# EAGLE design lastboard (EAGLE 7.6.0)

## Sheet 1 of 5
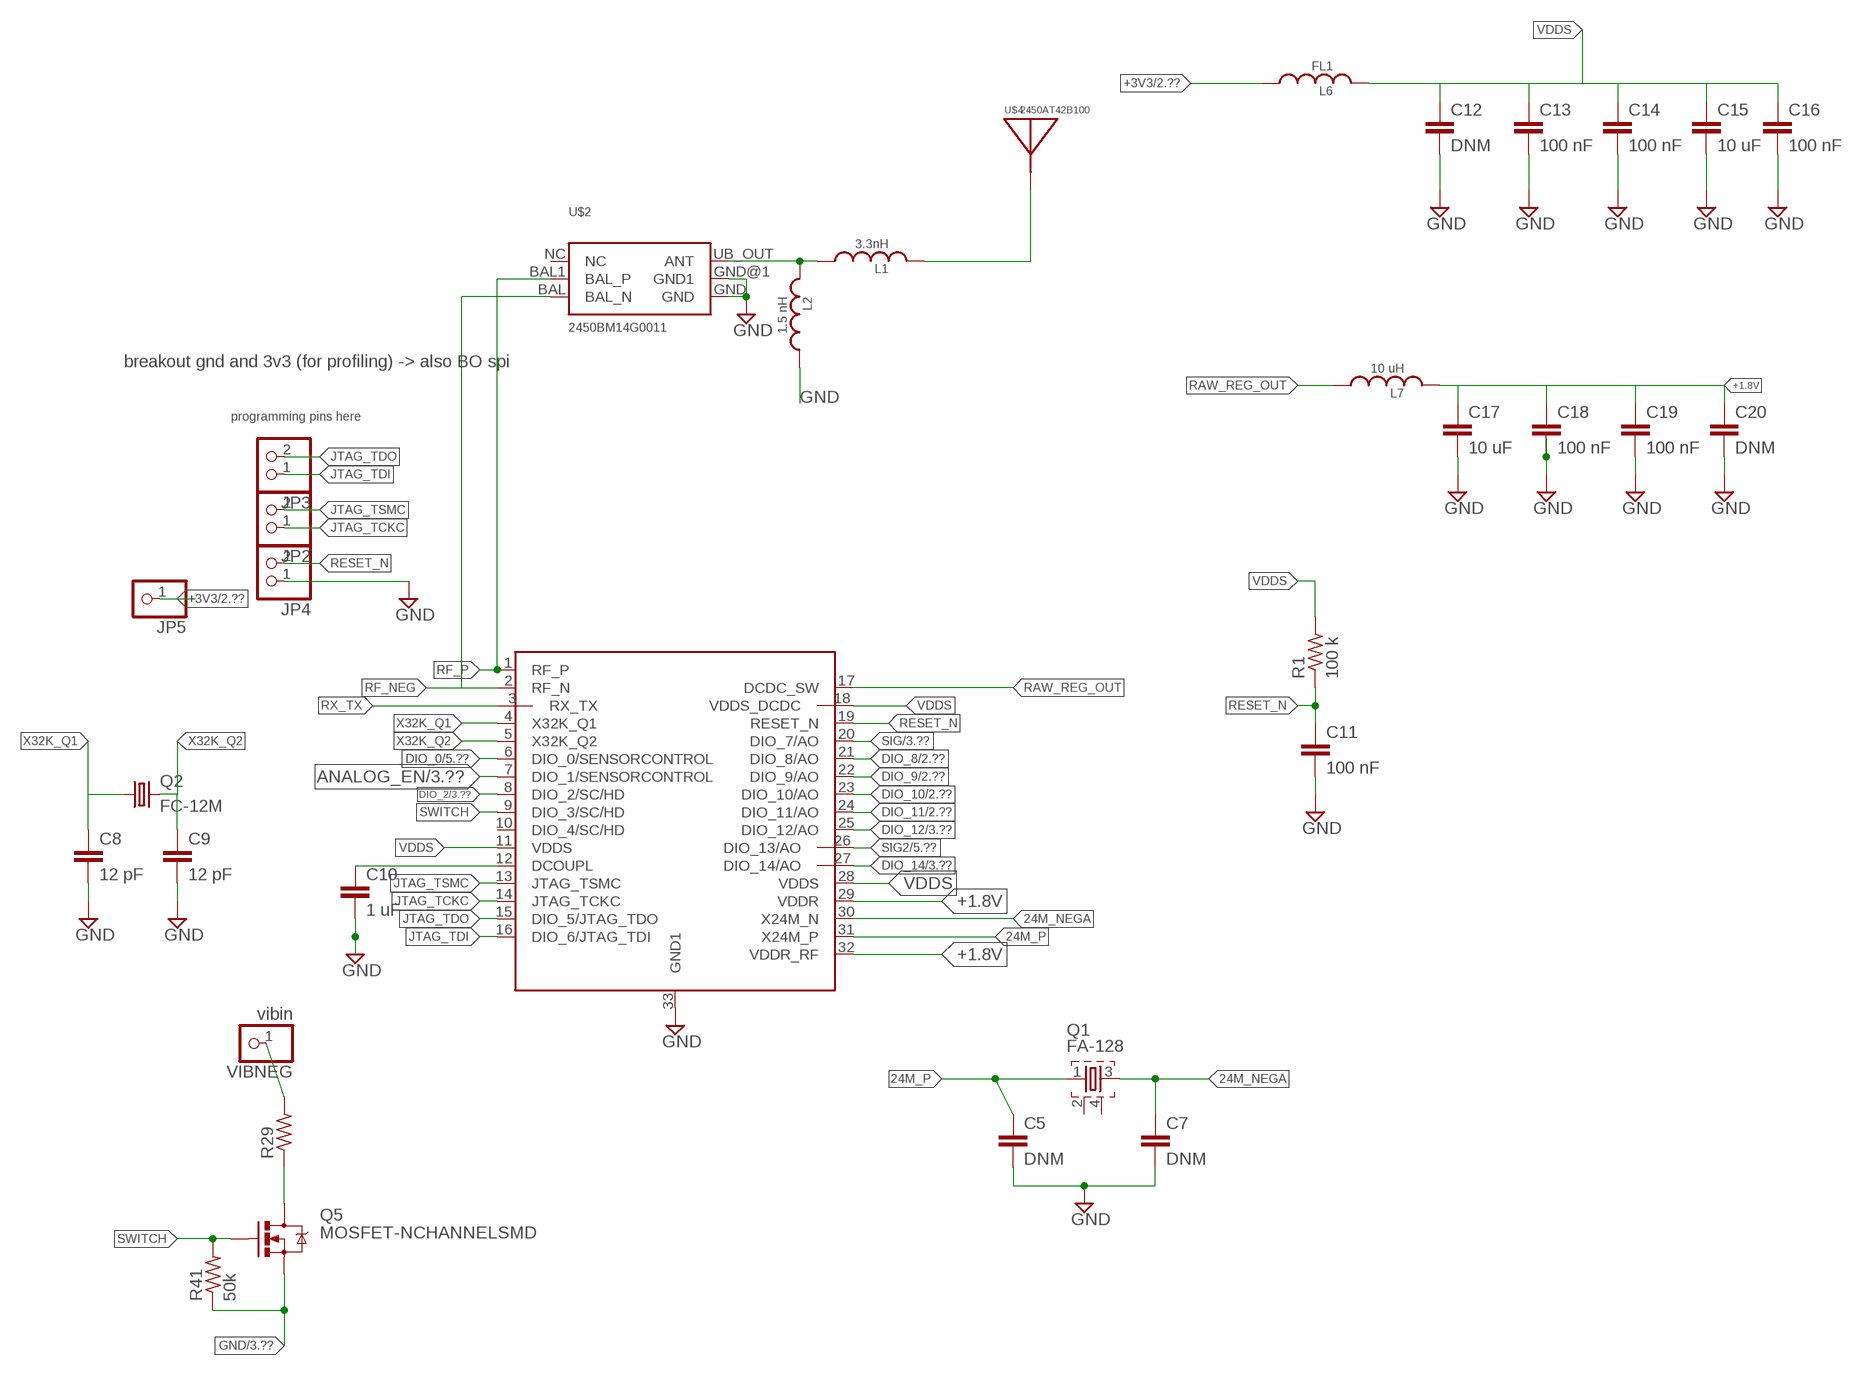
[diagram p0: schematic, sheet 1]

### Parts
C5  DNM  C-EUC0402  [C0402]
C7  DNM  C-EUC0402  [C0402]
C8  12 pF  C-EUC0402  [C0402]
C9  12 pF  C-EUC0402  [C0402]
C10  1 uF  C-EUC0402  [C0402]
C11  100 nF  C-EUC0402  [C0402]
C12  DNM  C-EUC0402  [C0402]
C13  100 nF  C-EUC0402  [C0402]
C14  100 nF  C-EUC0402  [C0402]
C15  10 uF  C-EUC0402  [C0402]
C16  100 nF  C-EUC0402  [C0402]
C17  10 uF  C-EUC0402  [C0402]
C18  100 nF  C-EUC0402  [C0402]
C19  100 nF  C-EUC0402  [C0402]
C20  DNM  C-EUC0402  [C0402]
JP2  PINHD-1X2  [1X02]
JP3  PINHD-1X2  [1X02]
JP4  PINHD-1X2  [1X02]
JP5  PINHD-1X1  [1X01]
L1  3.3nH  INDUCTOR0402  [0402_CAP]
L2  1.5 nH  INDUCTOR0402  [0402_CAP]
L6  FL1  INDUCTOR0603  [0603_CAP]
L7  10 uH  INDUCTOR0603  [0603_CAP]
Q1  FA-128  [FA-128]
Q2  FC-12M  [FC-12M]
Q5  MOSFET-NCHANNELSMD  [SOT23-3]
R1  100 k  R-US_R0402  [R0402]
R29  R-US_R0402  [R0402]
R41  50k  R-US_R0402  [R0402]
U$1  CC2640-5MM  [S-PVQFN-N32]
U$2  2450BM14G0011  [DFN/LCC-6]
U$4  2450AT42B100  [2450AT42B100]
VIBNEG  vibin  PINHD-1X1  [1X01]

### Nets
24M_NEGA: C7.1 Q1.3 U$1.30(X24M_N)
24M_P: C5.1 Q1.1 U$1.31(X24M_P)
+1.8V: C17.1 C18.1 C19.1 C20.1 L7.2 U$1.29(VDDR) U$1.32(VDDR_RF)
+3V3: JP5.1 L6.1 ; also sheet 2,3,4,5
ANALOG_EN: U$1.7(DIO_1/SENSORCONTROL) ; also sheet 3,4
DCOUPLE_ME: C10.1 U$1.12(DCOUPL)
DIO_0: U$1.6(DIO_0/SENSORCONTROL) ; also sheet 5
DIO_2: U$1.8(DIO_2/SC/HD) ; also sheet 3
DIO_8: U$1.21(DIO_8/AO) ; also sheet 2
DIO_9: U$1.22(DIO_9/AO) ; also sheet 2
DIO_10: U$1.23(DIO_10/AO) ; also sheet 2
DIO_11: U$1.24(DIO_11/AO) ; also sheet 2,3,5
DIO_12: U$1.25(DIO_12/AO) ; also sheet 3,5
DIO_14: U$1.27(DIO_14/AO) ; also sheet 3,5
GND: C5.2 C7.2 C8.2 C9.2 C10.2 C11.2 C12.2 C13.2 C14.2 C15.2 C16.2 C17.2 C18.2 C19.2 C20.2 JP4.1 L2.1 Q5.2(S) R41.1 U$1.33(GND1) U$2.GND U$2.GND@1(GND1) ; also sheet 2,3,4,5
JTAG_TCKC: JP2.1 U$1.14(JTAG_TCKC)
JTAG_TDI: JP3.1 U$1.16(DIO_6/JTAG_TDI)
JTAG_TDO: JP3.2 U$1.15(DIO_5/JTAG_TDO)
JTAG_TSMC: JP2.2 U$1.13(JTAG_TSMC)
MOTOROUT: R29.2 VIBNEG.1
N$4: L1.1 L2.2 U$2.UB_OUT(ANT)
N$7: L1.2 U$4.FEED(ANTENNA)
N$17: Q5.3(D) R29.1
RAW_REG_OUT: L7.1 U$1.17(DCDC_SW)
RESET_N: C11.1 JP4.2 R1.1 U$1.19(RESET_N)
RF_NEG: U$1.2(RF_N) U$2.BAL(BAL_N)
RF_P: U$1.1(RF_P) U$2.BAL1(BAL_P)
RX_TX: U$1.3(RX_TX)
SIG: U$1.20(DIO_7/AO) ; also sheet 3
SIG2: U$1.26(DIO_13/AO) ; also sheet 5
SWITCH: Q5.1(G) R41.2 U$1.9(DIO_3/SC/HD)
VDDS: C12.1 C13.1 C14.1 C15.1 C16.1 L6.2 R1.2 U$1.11(VDDS) U$1.18(VDDS_DCDC) U$1.28(VDDS)
X32K_Q1: C8.1 Q2.1 U$1.4(X32K_Q1)
X32K_Q2: C9.1 Q2.2 U$1.5(X32K_Q2)
Unconnected: Q1.2 Q1.4 U$1.10(DIO_4/SC/HD) U$2.NC

### Notes on the sheet
- breakout gnd and 3v3 (for profiling) -> also BO spi
- programming pins here

## Sheet 2 of 5
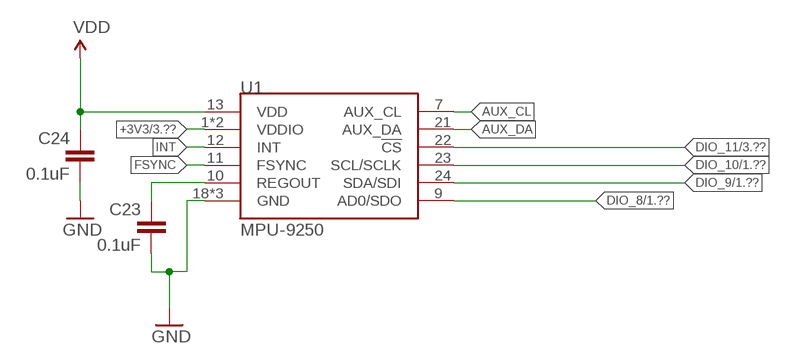
[diagram p1: schematic, sheet 2]

### Parts
C23  0.1uF  0.1UF-25V(+80/-20%)(0603)  [0603-CAP]
C24  0.1uF  0.1UF-25V(+80/-20%)(0603)  [0603-CAP]
U1  MPU-9250  [QFN24_PAD]

### Nets
+3V3: C24.1 U1.1(VDDIO) U1.8(VDDIO) U1.13(VDD) ; supply symbol labelled VDD ; also sheet 1,3,4,5
ADSD_STUB: U1.9(AD0/SDO)
AUX_CL: U1.7(AUX_CL)
AUX_DA: U1.21(AUX_DA)
DIO_9: U1.24(SDA/SDI) ; also sheet 1
DIO_10: U1.23(SCL/SCLK) ; also sheet 1
DIO_11: U1.22(!CS) ; also sheet 1,3,5
FSYNC: U1.11(FSYNC)
GND: C23.2 C24.2 U1.18(GND) U1.20(GND) U1.CENTER(GND) ; also sheet 1,3,4,5
INT: U1.12(INT)
REGOUT: C23.1 U1.10(REGOUT)

## Sheet 3 of 5
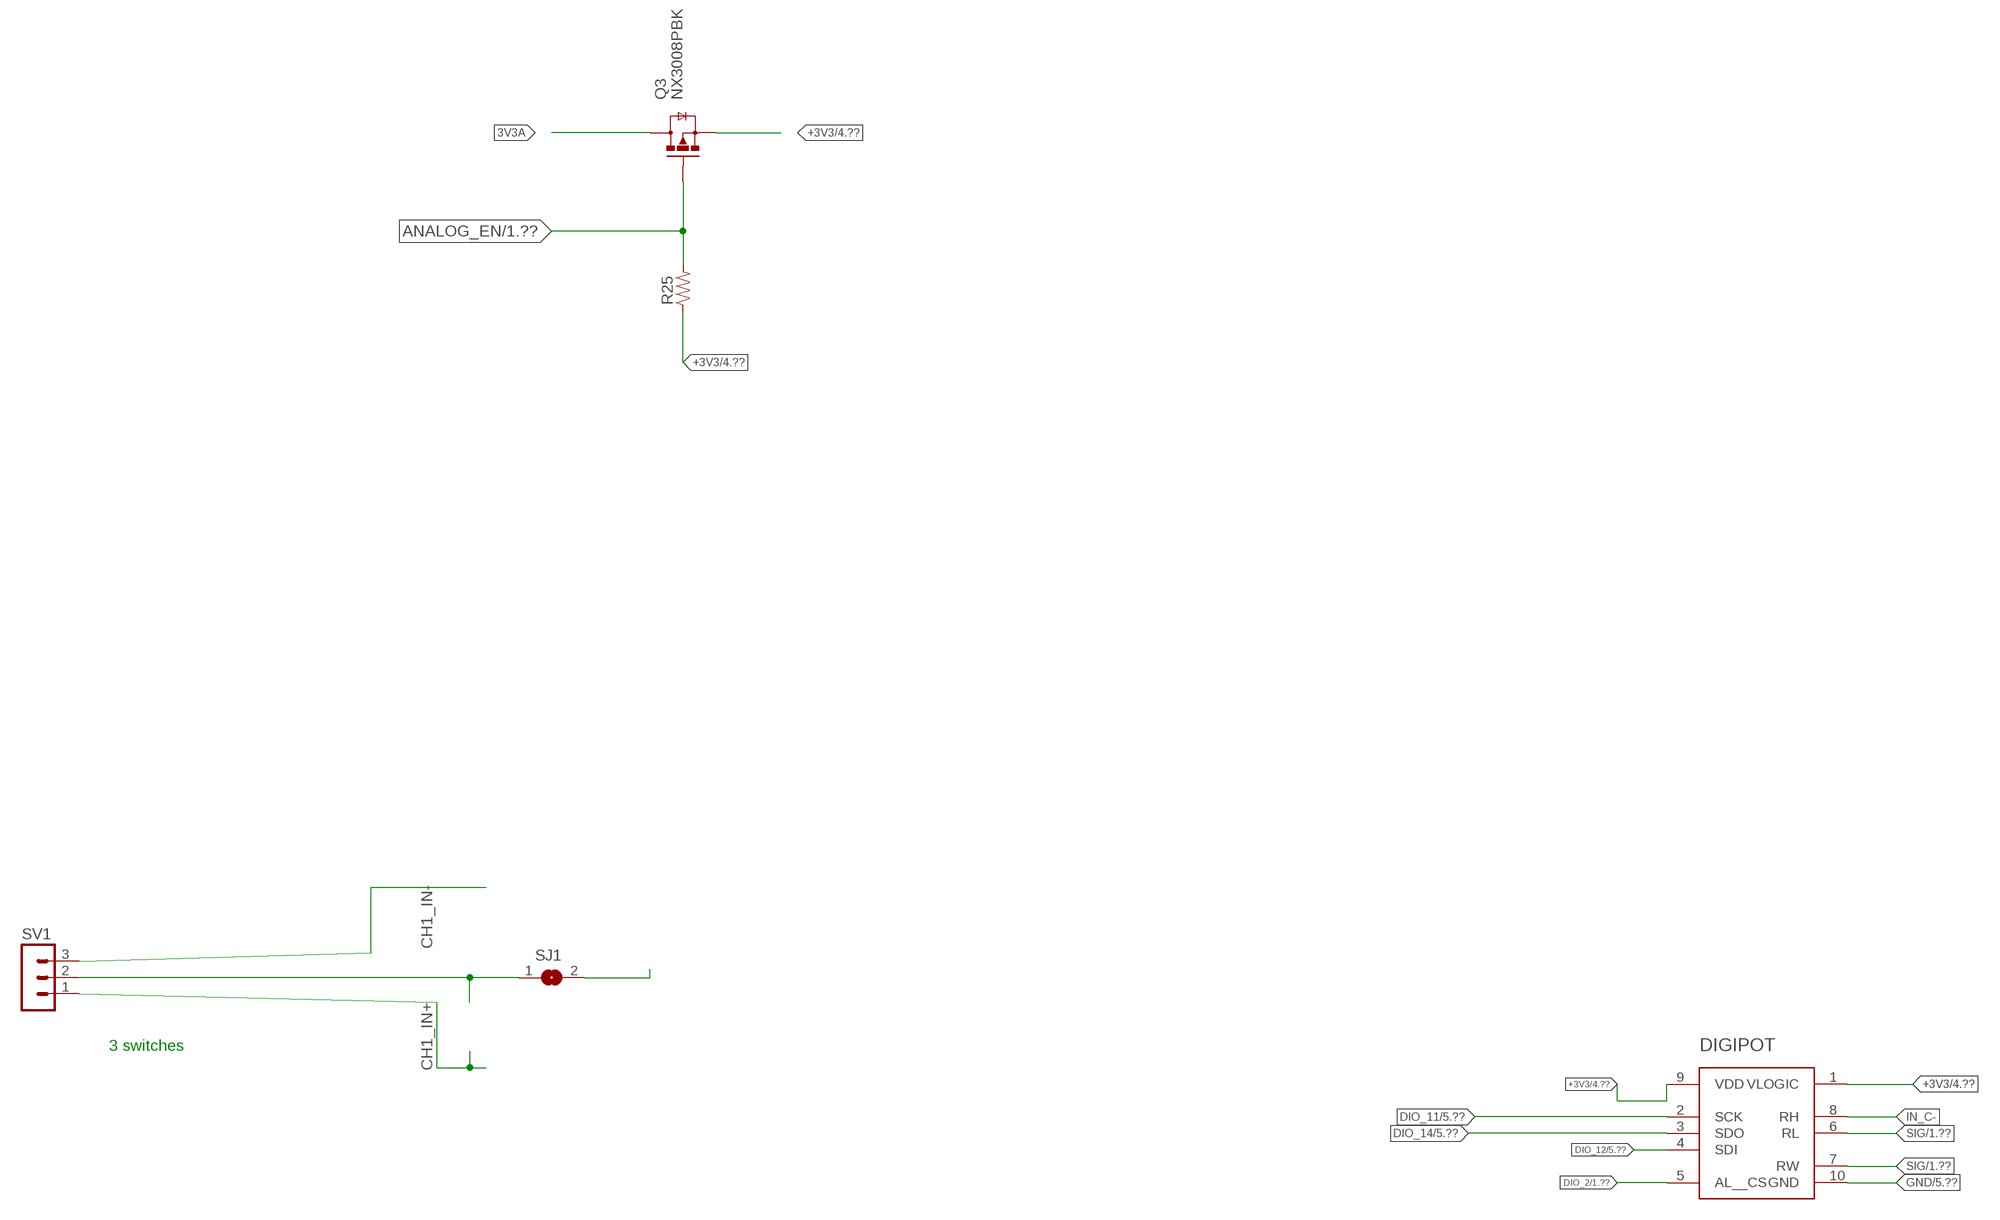
[diagram p2: schematic, sheet 3, part 1 of 2]
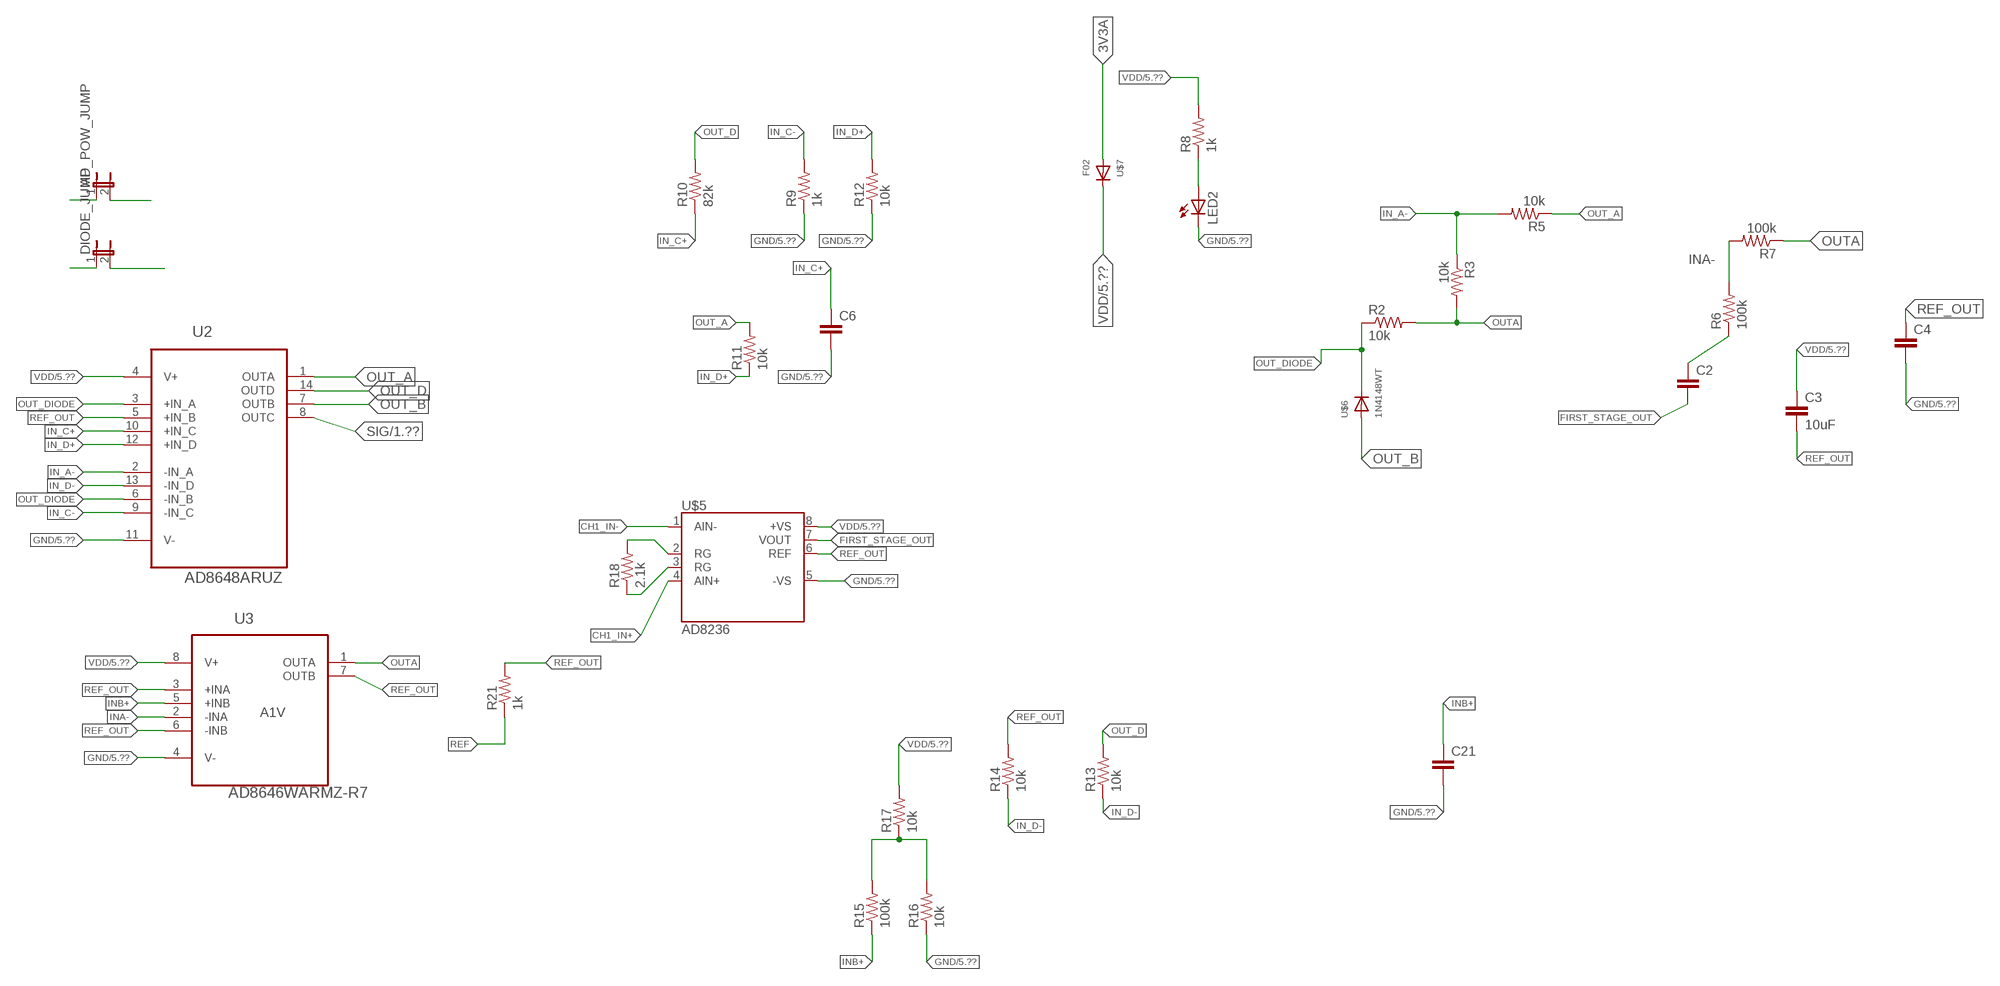
[diagram p3: schematic, sheet 3, part 2 of 2]

### Parts
AD_POW_JUMP  JUMPER-2SMD-NO  [SJ_2S-NO]
C2  C-EUC0603  [C0603]
C3  10uF  C-EUC0603  [C0603]
C4  C-EUC0603  [C0603]
C6  C-EUC0603  [C0603]
C21  C-EUC0603  [C0603]
DIGIPOT  ISL23418  [MSOP10]
DIODE_JUMP  JUMPER-2SMD-NO  [SJ_2S-NO]
LED2  LED0603  [LED-0603]
Q3  NX3008PBK  [SOT23-3]
R2  10k  R-US_R0603  [R0603]
R3  10k  R-US_R0603  [R0603]
R5  10k  R-US_R0603  [R0603]
R6  100k  R-US_R0603  [R0603]
R7  100k  R-US_R0603  [R0603]
R8  1k  R-US_R0603  [R0603]
R9  1k  R-US_R0603  [R0603]
R10  82k  R-US_R0603  [R0603]
R11  10k  R-US_R0603  [R0603]
R12  10k  R-US_R0603  [R0603]
R13  10k  R-US_R0603  [R0603]
R14  10k  R-US_R0603  [R0603]
R15  100k  R-US_R0603  [R0603]
R16  10k  R-US_R0603  [R0603]
R17  10k  R-US_R0603  [R0603]
R18  2.1k  R-US_R0603  [R0603]
R21  1k  R-US_R0603  [R0603]
R25  RESISTOR0603_RES  [0603-RES]
SJ1  SJ  [SJ]
SV1  MA03-1  [MA03-1]
U2  AD8648ARUZ  [SOP65P640X120-14N]
U3  AD8646WARMZ-R7  [SOP65P490X110-8N]
U$5  AD8236  [MSOP8]
U$6  1N4148WT  [SOD-523]
U$7  F02  [SOD-523]

### Nets
3V3A: AD_POW_JUMP.2 DIODE_JUMP.1 Q3.3(D) U$7.A
+3V3: AD_POW_JUMP.1 DIGIPOT.1(VLOGIC) DIGIPOT.9(VDD) Q3.2(S) R25.1 ; also sheet 1,2,4,5
ANALOG_EN: Q3.1(G) R25.2 ; also sheet 1,4
CH1_IN+: SV1.1 U$5.4(AIN+)
CH1_IN-: SV1.3 U$5.1(AIN-)
DIO_2: DIGIPOT.5(AL__CS) ; also sheet 1
DIO_11: DIGIPOT.2(SCK) ; also sheet 1,2,5
DIO_12: DIGIPOT.4(SDI) ; also sheet 1,5
DIO_14: DIGIPOT.3(SDO) ; also sheet 1,5
FIRST_STAGE_OUT: C2.2 U$5.7(VOUT)
GND: C4.2 C6.2 C21.2 DIGIPOT.10(GND) LED2.C R9.1 R12.1 R16.1 U2.11(V-) U3.4(V-) U$5.5(-VS) ; also sheet 1,2,4,5
IN_A-: R3.1 R5.2 U2.2(-IN_A)
IN_C+: C6.1 R10.1 U2.10(+IN_C)
IN_C-: DIGIPOT.8(RH) R9.2 U2.9(-IN_C)
IN_D+: R11.1 R12.2 U2.12(+IN_D)
IN_D-: R13.1 R14.1 U2.13(-IN_D)
INA-: R6.2 R7.2 U3.2(-INA)
INB+: C21.1 R15.1 U3.5(+INB)
N$1: C2.1 R6.1
N$6: R18.2 U$5.2(RG)
N$8: R15.2 R16.2 R17.1
N$10: LED2.A R8.1
N$11: R18.1 U$5.3(RG)
OUT_A: R5.1 R11.2 U2.1(OUTA)
OUT_B: U2.7(OUTB) U$6.A
OUT_D: R10.2 R13.2 U2.14(OUTD)
OUT_DIODE: R2.1 U2.3(+IN_A) U2.6(-IN_B) U$6.K(C)
OUTA: R2.2 R3.2 R7.1 U3.1(OUTA)
REF: R21.1 SJ1.1 SV1.2
REF2: SJ1.2 ; also sheet 5
REF_OUT: C3.2 C4.1 R14.2 R21.2 U2.5(+IN_B) U3.3(+INA) U3.6(-INB) U3.7(OUTB) U$5.6(REF)
SIG: DIGIPOT.6(RL) DIGIPOT.7(RW) U2.8(OUTC) ; also sheet 1
VDD: C3.1 DIODE_JUMP.2 R8.2 R17.2 U2.4(V+) U3.8(V+) U$5.8(+VS) U$7.K(C) ; also sheet 5

### Notes on the sheet
- A1V
- 3 switches

## Sheet 4 of 5
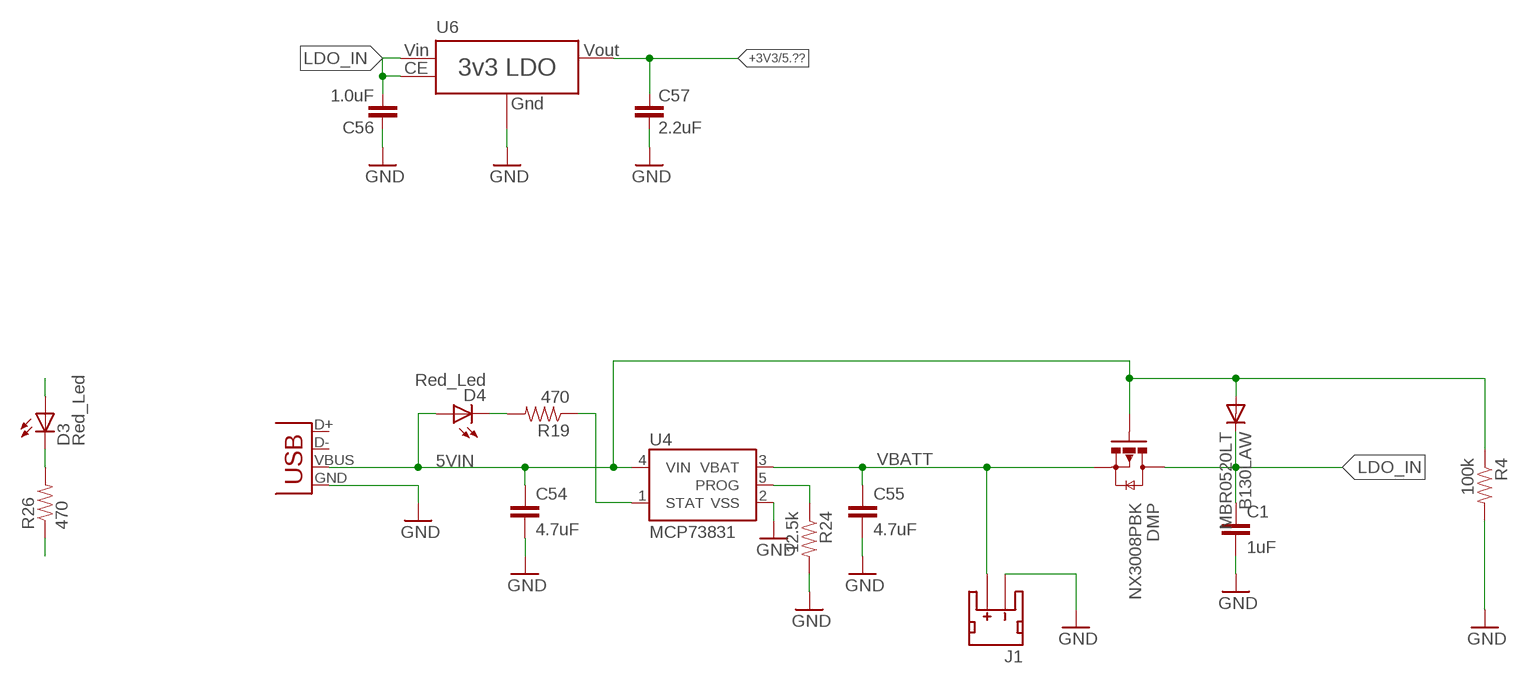
[diagram p4: schematic, sheet 4]

### Parts
B130LAW  MBR0520LT  [SOD123]
C1  1uF  CAP0402-CAP  [0402-CAP]
C54  4.7uF  CAP0402-CAP  [0402-CAP]
C55  4.7uF  CAP0402-CAP  [0402-CAP]
C56  1.0uF  C-EUC0805  [C0805]
C57  2.2uF  C-EUC0805  [C0805]
D3  Red_Led  LED0603  [LED-0603]
D4  Red_Led  LED0603  [LED-0603]
DMP  NX3008PBK  [SOT23-3]
J1  JST_2MM_MALE  [JST-2-SMD]
R4  100k  RESISTOR0402-RES  [0402-RES]
R19  470  RESISTOR0402-RES  [0402-RES]
R24  12.5k  RESISTOR0402-RES  [0402-RES]
R26  470  RESISTOR0402-RES  [0402-RES]
U4  MCP73831  [SOT23-5]
U6  XC6210  [SOT-25]
X1  USB-MICROB  [USB-MICROB]

### Nets
5VIN: B130LAW.A C54.1 D4.A DMP.1(G) R4.1 U4.4(VIN) X1.VBUS
+3V3: C57.1 U6.5(VOUT) ; also sheet 1,2,3,5
ANALOG_EN: D3.A ; also sheet 1,3
GND: C1.2 C54.2 C55.2 C56.1 C57.2 J1.1(-) R4.2 R24.2 R26.1 U4.2(VSS) U6.2(GND) X1.GND ; also sheet 1,2,3,5
LDO_IN: B130LAW.C C1.1 C56.2 DMP.3(D) U6.1(VIN) U6.3(CE)
N$2: R24.1 U4.5(PROG)
N$3: D4.C R19.2
N$5: D3.C R26.2
N$14: R19.1 U4.1(STAT)
VBATT: C55.1 DMP.2(S) J1.2(+) U4.3(VBAT)
Unconnected: J1.NC1(PAD1) J1.NC2(PAD2) X1.D+ X1.D-

## Sheet 5 of 5
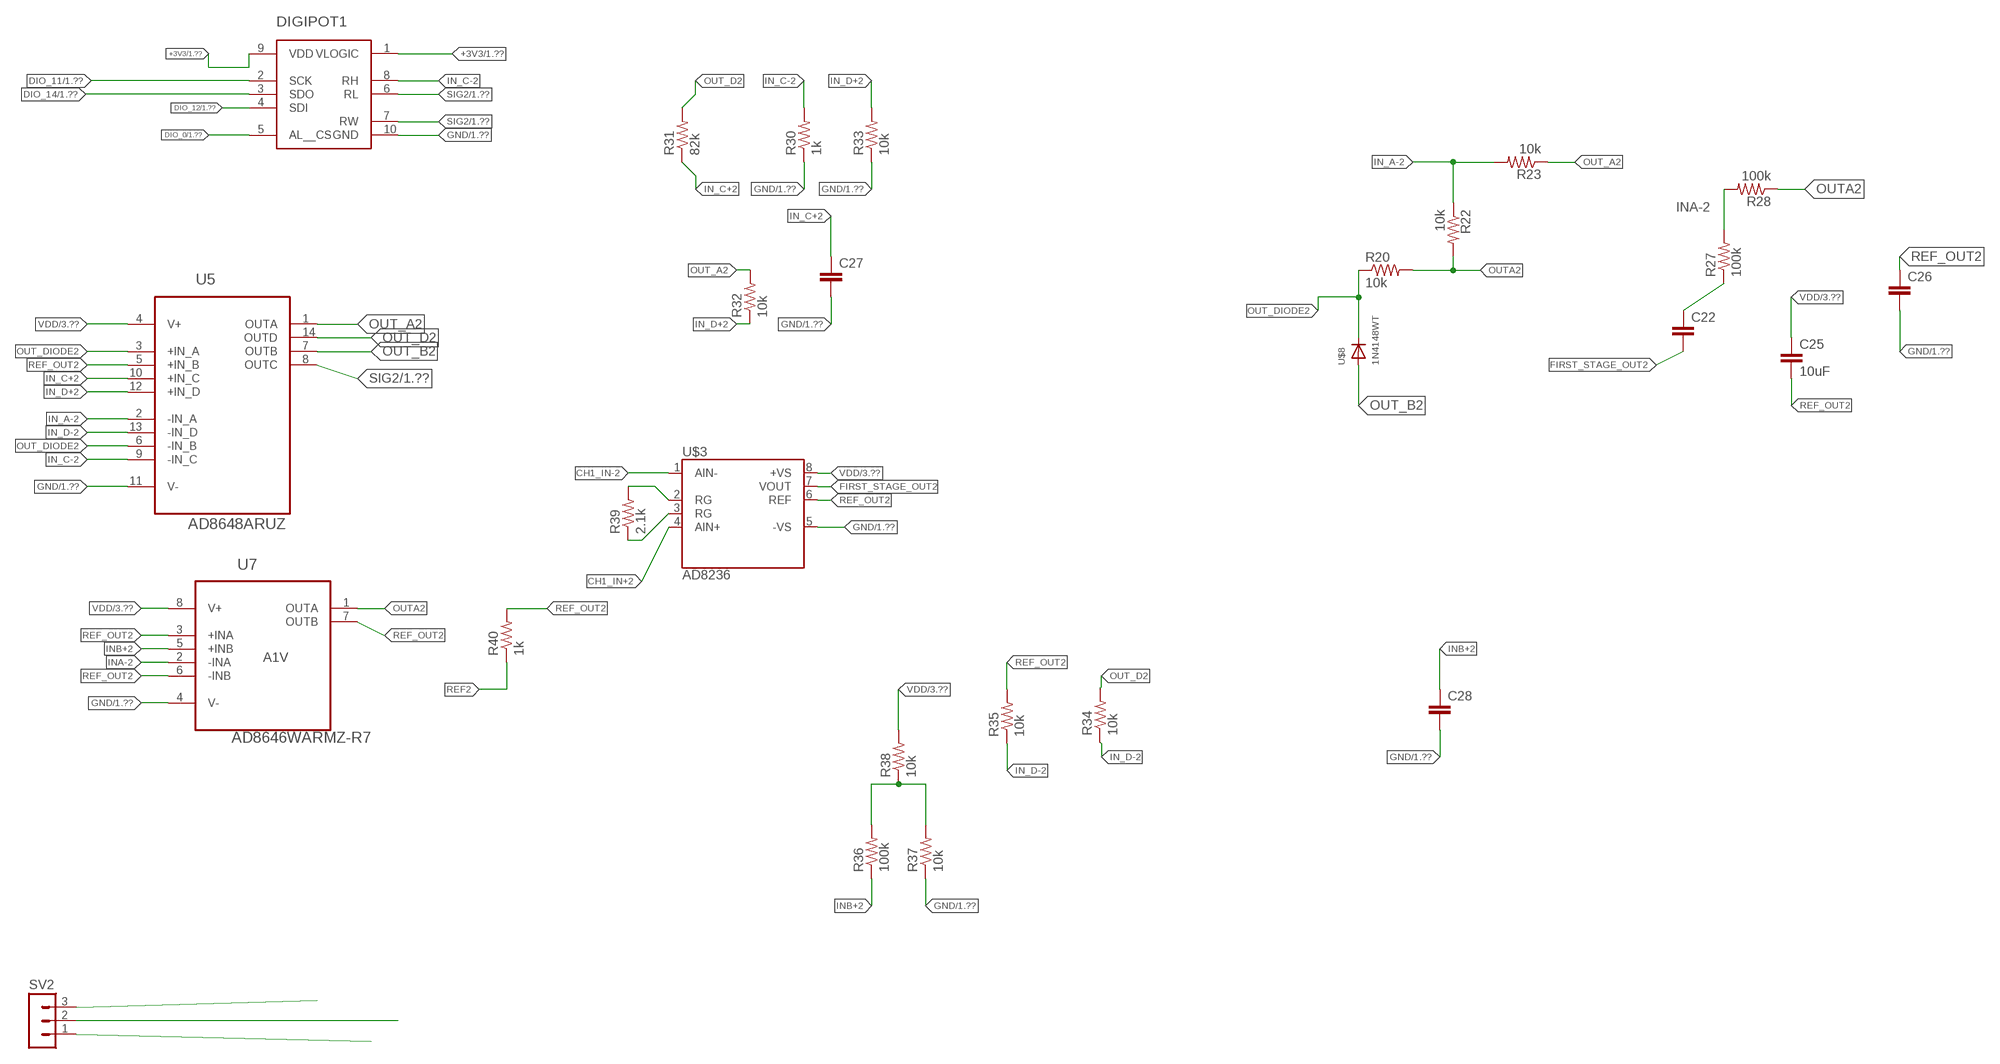
[diagram p5: schematic, sheet 5]

### Parts
C22  C-EUC0603  [C0603]
C25  10uF  C-EUC0603  [C0603]
C26  C-EUC0603  [C0603]
C27  C-EUC0603  [C0603]
C28  C-EUC0603  [C0603]
DIGIPOT1  ISL23418  [MSOP10]
R20  10k  R-US_R0603  [R0603]
R22  10k  R-US_R0603  [R0603]
R23  10k  R-US_R0603  [R0603]
R27  100k  R-US_R0603  [R0603]
R28  100k  R-US_R0603  [R0603]
R30  1k  R-US_R0603  [R0603]
R31  82k  R-US_R0603  [R0603]
R32  10k  R-US_R0603  [R0603]
R33  10k  R-US_R0603  [R0603]
R34  10k  R-US_R0603  [R0603]
R35  10k  R-US_R0603  [R0603]
R36  100k  R-US_R0603  [R0603]
R37  10k  R-US_R0603  [R0603]
R38  10k  R-US_R0603  [R0603]
R39  2.1k  R-US_R0603  [R0603]
R40  1k  R-US_R0603  [R0603]
SV2  MA03-1  [MA03-1]
U5  AD8648ARUZ  [SOP65P640X120-14N]
U7  AD8646WARMZ-R7  [SOP65P490X110-8N]
U$3  AD8236  [MSOP8]
U$8  1N4148WT  [SOD-523]

### Nets
+3V3: DIGIPOT1.1(VLOGIC) DIGIPOT1.9(VDD) ; also sheet 1,2,3,4
CH1_IN+2: SV2.1 U$3.4(AIN+)
CH1_IN-2: SV2.3 U$3.1(AIN-)
DIO_0: DIGIPOT1.5(AL__CS) ; also sheet 1
DIO_11: DIGIPOT1.2(SCK) ; also sheet 1,2,3
DIO_12: DIGIPOT1.4(SDI) ; also sheet 1,3
DIO_14: DIGIPOT1.3(SDO) ; also sheet 1,3
FIRST_STAGE_OUT2: C22.2 U$3.7(VOUT)
GND: C26.2 C27.2 C28.2 DIGIPOT1.10(GND) R30.1 R33.1 R37.1 U5.11(V-) U7.4(V-) U$3.5(-VS) ; also sheet 1,2,3,4
IN_A-2: R22.1 R23.2 U5.2(-IN_A)
IN_C+2: C27.1 R31.1 U5.10(+IN_C)
IN_C-2: DIGIPOT1.8(RH) R30.2 U5.9(-IN_C)
IN_D+2: R32.1 R33.2 U5.12(+IN_D)
IN_D-2: R34.1 R35.1 U5.13(-IN_D)
INA-2: R27.2 R28.2 U7.2(-INA)
INB+2: C28.1 R36.1 U7.5(+INB)
N$12: C22.1 R27.1
N$13: R39.2 U$3.2(RG)
N$15: R39.1 U$3.3(RG)
N$16: R36.2 R37.2 R38.1
OUT_A2: R23.1 R32.2 U5.1(OUTA)
OUT_B2: U5.7(OUTB) U$8.A
OUT_D2: R31.2 R34.2 U5.14(OUTD)
OUT_DIODE2: R20.1 U5.3(+IN_A) U5.6(-IN_B) U$8.K(C)
OUTA2: R20.2 R22.2 R28.1 U7.1(OUTA)
REF2: R40.1 SV2.2 ; also sheet 3
REF_OUT2: C25.2 C26.1 R35.2 R40.2 U5.5(+IN_B) U7.3(+INA) U7.6(-INB) U7.7(OUTB) U$3.6(REF)
SIG2: DIGIPOT1.6(RL) DIGIPOT1.7(RW) U5.8(OUTC) ; also sheet 1
VDD: C25.1 R38.2 U5.4(V+) U7.8(V+) U$3.8(+VS) ; also sheet 3

### Notes on the sheet
- A1V

## Library data of the parts
AD_POW_JUMP DIODE_JUMP = umich:JUMPER-2: Jumper Basic 0.1" spaced jumper. Use with breakaway headers.
B130LAW = diode:MBR0520LT: SCHOTTKY BARRIER RECTIFIER Source: http://onsemi.com .. MBR0520LT1-D.pdf
C1 C54 C55 = SparkFun:CAP: Capacitor Standard 0603 ceramic capacitor, and 0.1" leaded capacitor.
C2-C22 C25-C28 = rcl:C-EU: CAPACITOR, European symbol
C23 C24 = SparkFun-Capacitors:0.1UF-25V(+80/-20%)(0603): CAP-00810 Ceramic Standard decoupling cap; PROD_ID: CAP-00810
C56 C57 = Jon_LIB:C-EU: CAPACITOR, European symbol
D3 D4 = SparkFun:LED: LEDs Standard schematic elements and footprints for 5mm, 3mm, 1206, and 0603 sized LEDs. 5mm - Spark Fun Electronics SKU : COM-00529 (and others)
DIGIPOT DIGIPOT1 = chips:ISL23418; DIGIKEY: ISL23418TFUZ-T7ACT-ND
DMP Q3 = fets:NX3008PBK: MOSFET - P Channel; DIGIKEY: 568-10499-1-ND; MOUSER: 771-NX3008PBK,215; NEWARK: 74T4665
J1 = SparkFun-Connectors:JST_2MM_MALE: Mates to single-cell LiPo batteries. CONN-08352; PROD_ID: CONN-08352
JP2-JP4 = pinhead:PINHD-1X2: PIN HEADER
JP5 VIBNEG = pinhead:PINHD-1X1: PIN HEADER
L1 L2 L6 L7 = passives:INDUCTOR: A very specific inductor
LED2 = SparkFun-LED:LED: LEDs Standard schematic elements and footprints for 5mm, 3mm, 1206, and 0603 sized LEDs. 5mm - Spark Fun Electronics SKU : COM-00529 (and others)
Q1 = crystal:FA-: MHz RANGE CRYSTAL UNIT Source: Epson Toyocom
Q2 = crystal:FC-12M: kHz RANGE CRYSTAL UNIT LOW PROFILE SMD Source: Epson Toyocom FC-12M.pdf
Q5 = fets:MOSFET-NCHANNEL: Generic NMOS footprint
R1-R3 R5-R18 R20-R23 R27-R41 = rcl:R-US_: RESISTOR, American symbol
R4 R19 R24 R26 = SparkFun:RESISTOR: Resistor Basic schematic elements and footprints for 0603, 1206, and PTH resistors.
R25 = passives:RESISTOR: Resistor Basic schematic elements and footprints for 0603, 1206, and PTH resistors.
SJ1 = jumper:SJ: SMD solder JUMPER
SV1 SV2 = con-lstb:MA03-1: PIN HEADER; OC_FARNELL: unknown; OC_NEWARK: unknown
U1 = Testing:MPU-9250: NC pin 19. 2-6 & 14-17 not internally connected. May be used for PCB trace routing.; PROD_ID: IC-13192
U2 U5 = Analog Devices_By_element14_Batch_1:AD8648ARUZ: Rail-to-Rail Amplifiers; MPN: AD8648ARUZ; OC_FARNELL: 1274217; OC_NEWARK: 19M0988; PACKAGE: TSSOP-14; SUPPLIER: Analog Devices
U3 U7 = Analog Devices_By_element14_Batch_1:AD8646WARMZ-R7: 24 MHz Rail-to-Rail Amplifiers with Shutdown Option; MPN: AD8646WARMZ-R7; OC_FARNELL: -; OC_NEWARK: 74R6010; PACKAGE: MSOP-8; SUPPLIER: Analog Devices
U4 = SparkFun:MCP73831: Microchip's MCP73831 Miniature single cell, fully integrated Li-Ion, Li-polymer charge management controller http://ww1.microchip.com/downloads/en/DeviceDoc/21984a.pdf
U6 = MAAV:XC6210; DIGIKEY#: 893-1075-1-ND
U$1 = chips:CC2640-5MM
U$2 = chips:2450BM14G0011; DIGIKEY: 712-1620-1-ND
U$3 U$5 = SparkFun-AnalogIC:AD8236; DIGIKEY: AD8236ARMZ-R7CT-ND
U$4 = chips:2450AT42B100; DIGIKEY: 712-1008-1-ND
U$6 U$8 = adafruit:1N4148WT; DIGIKEY: 1N4148WTCT-ND
U$7 = adafruit:F02
X1 = SparkFun:USB: USB Connectors USB-B-PTH is fully proven SKU : PRT-00139 USB-miniB is fully proven SKU : PRT-00587 USB-A-PCB is untested. USB-A-H is throughly reviewed, but untested. Spark Fun Electronics SKU : PRT-00437 USB-B-SMT is throughly reviewed, but untested. Needs silkscreen touching up. USB-A-S has not been used/tested USB-MB-H has not been used/tested

## Net classes
1 pwr: width 0.4 mm, drill 0.6 mm, clearance 0.23 mm

## Board
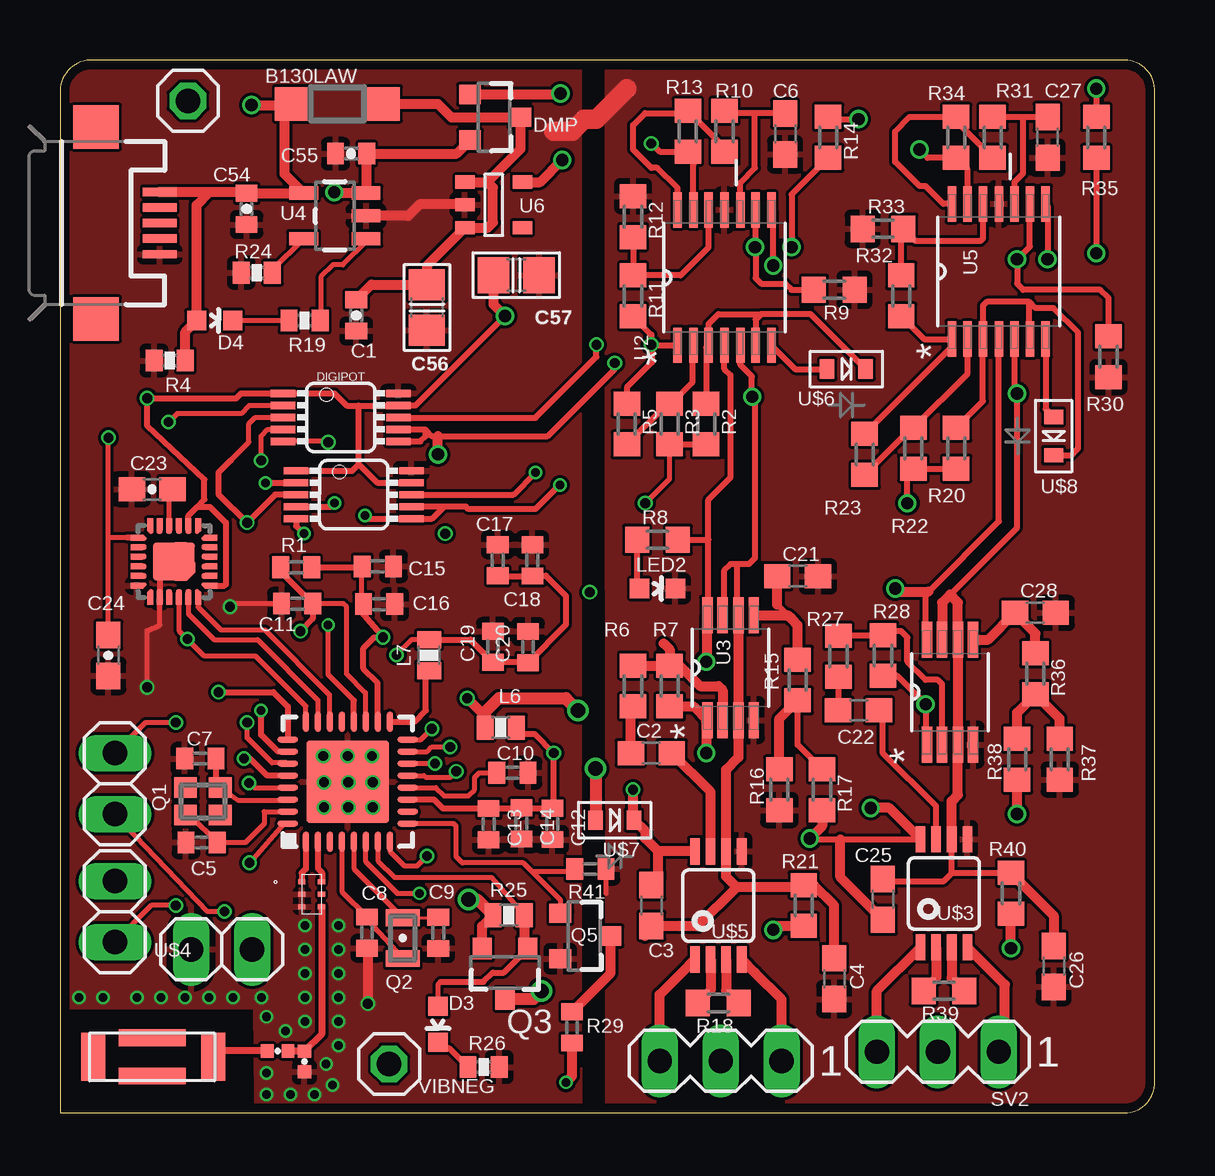
[diagram p6: board, top side]
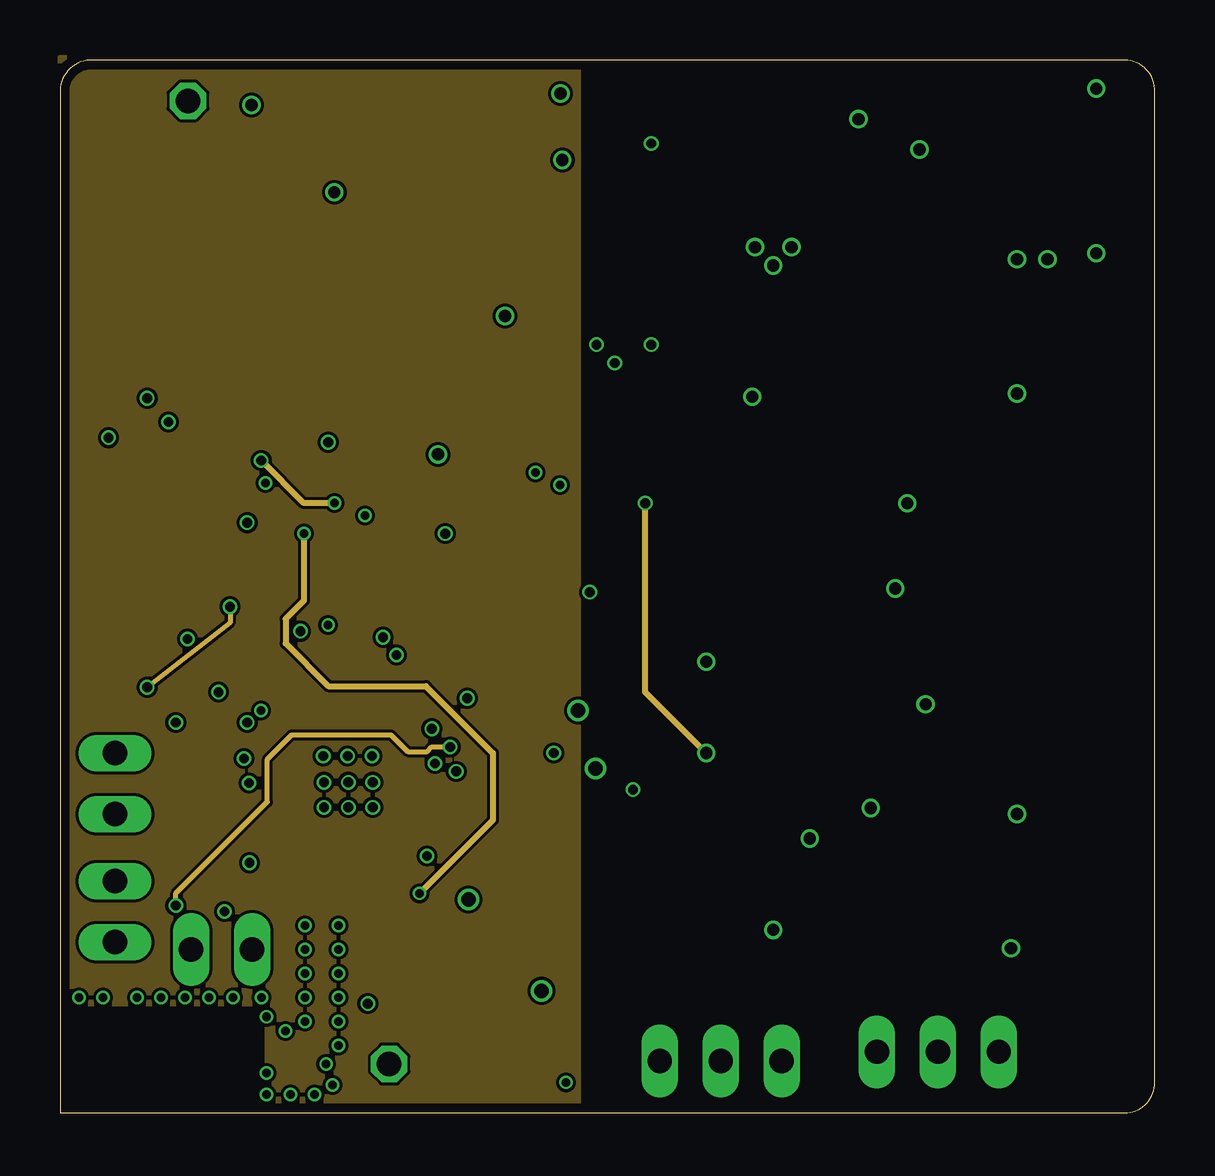
[diagram p7: board, inner layer Route2]
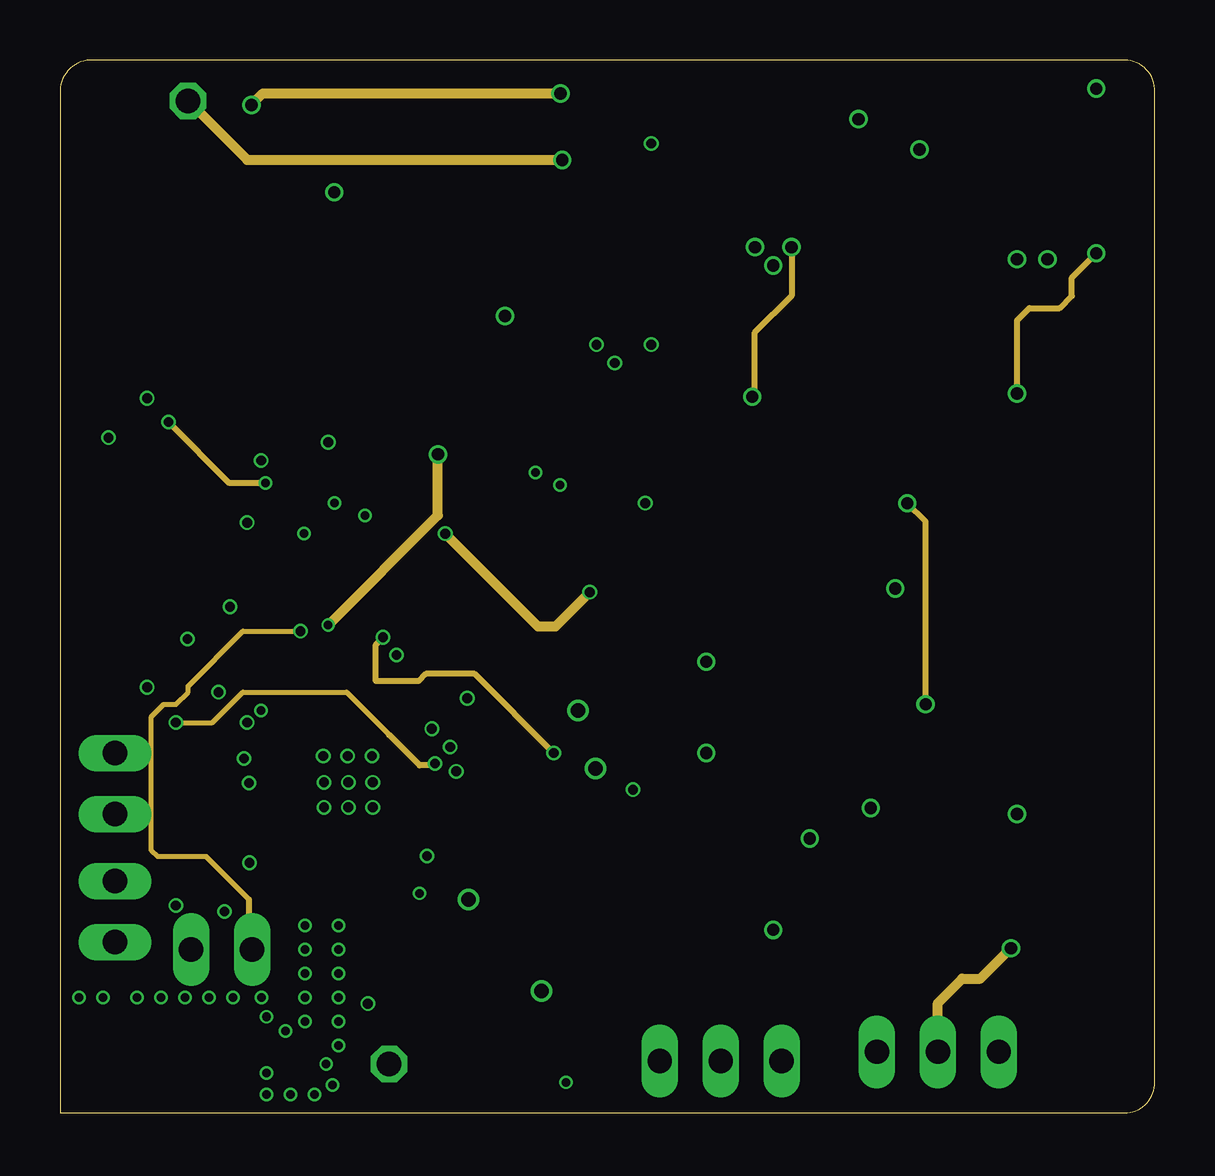
[diagram p8: board, inner layer Route15]
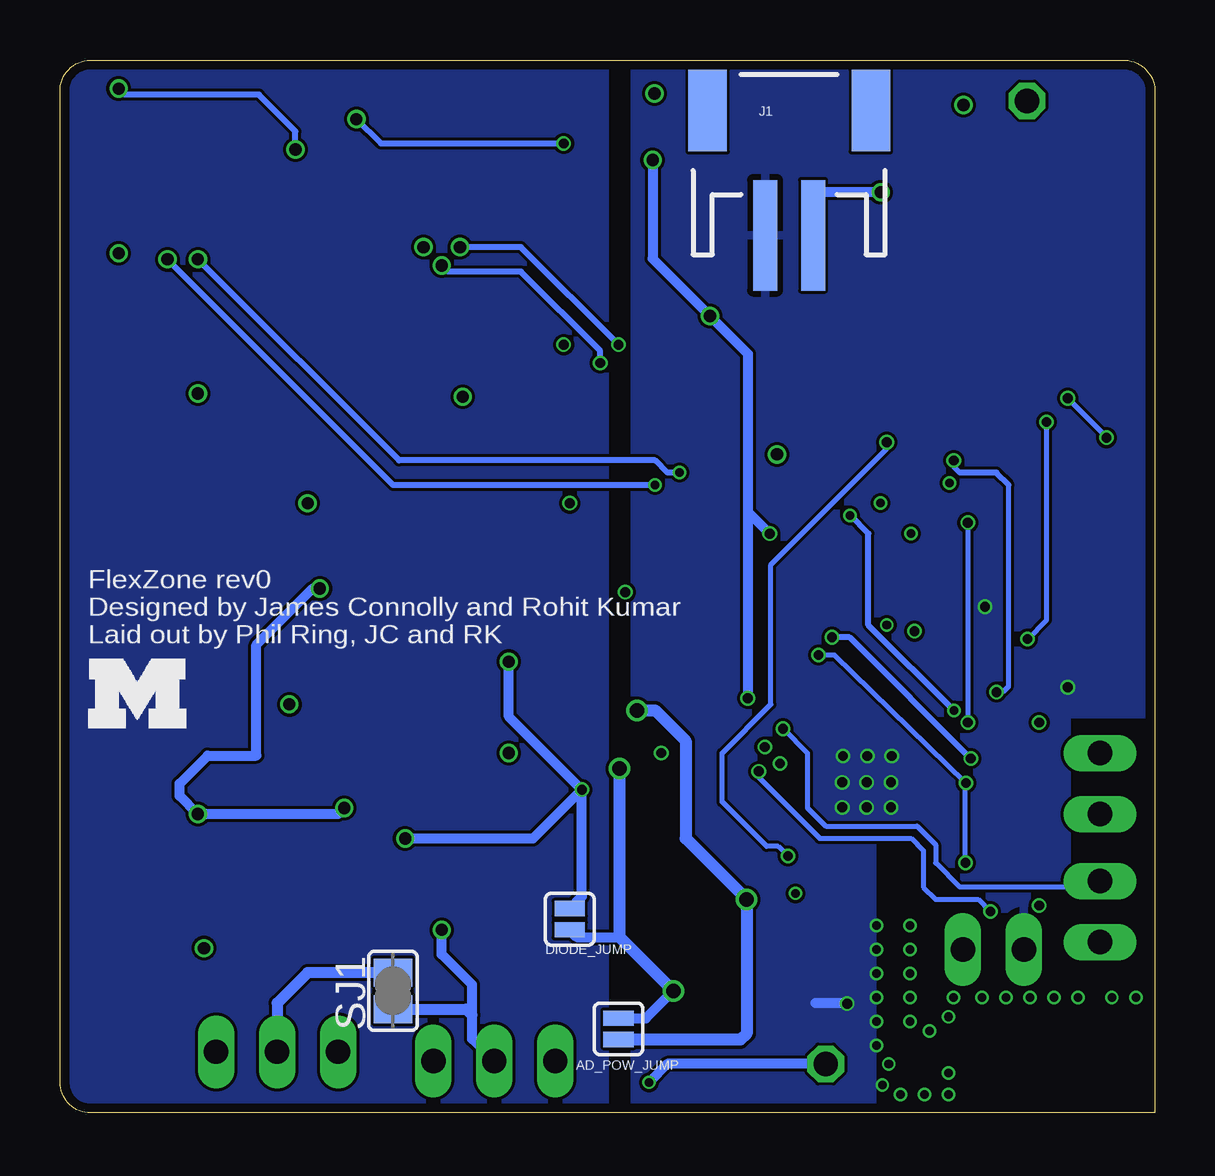
[diagram p9: board, bottom side, seen from below]

Size 45.62 x 43.86 mm. Coordinates in mm from the lower left corner, seen from the top.
Outline: 0,0 44.35,0 arc90 45.62,1.27 45.62,42.55 arc90 44.35,43.87 1.37,43.87 arc90 0,42.6 0,0
Copper layers (1*2*15*16): Top 0.035559375mm / dielectric 0.17018125mm / Route2 0.01778125mm / dielectric 47mil / Route15 0.01778125mm / dielectric 0.17018125mm / Bottom 0.035559375mm
Design rules "OSHPark-4layer": minimum track width 5mil, minimum drill 10mil, track to track 5mil, track to pad 5mil, pad to pad 5mil, via to via 5mil, smd to smd 5mil, copper to edge 15mil, drill to drill 6mil, minimum pad ring 4mil, minimum via ring 4mil, stop-mask expansion 2.5mil, vias tented up to drill 0mil, thermal gap 10mil

### Footprints (pad centres in the part's own frame; a part is rotated, then mirrored left to right if it is on the bottom)
SJ_2S-NO = smd 0.635 x 1.27: 1 0,0; 2 0.889,0
SOD123 = smd 1.4 x 1.4: A 1.9,0; C -1.9,0
0402-CAP = smd 0.7 x 0.9: 1 -0.65,0; 2 0.65,0
C0603 = smd 1.1 x 1: 1 -0.85,0; 2 0.85,0
C0402 = smd 0.7 x 0.9: 1 -0.65,0; 2 0.65,0
0603-CAP = smd 1.1 x 1: 1 -0.85,0; 2 0.85,0
C0805 = smd 1.3 x 1.5: 1 -0.95,0; 2 0.95,0
LED-0603 = smd 0.8 x 0.8: A 0,-0.75; C 0,0.75
MSOP10 = smd 0.3 x 1.02: 1 -1.1,-2.1; 2 -0.6,-2.1; 3 -0.1,-2.1; 4 0.4,-2.1; 5 0.9,-2.1; 6 0.9,2.7; 7 0.4,2.7; 8 -0.1,2.7; 9 -0.6,2.7; 10 -1.1,2.7
SOT23-3 = smd 0.8 x 0.9: 1 -0.95,-1; 2 0.95,-1; 3 0,1.1
JST-2-SMD = smd 1 x 4.6: 1 -1,-3.7; 2 1,-3.7 | smd 1.6 x 3.4: NC1 -3.4,1.5; NC2 3.4,1.5
1X02 = drill 1.016 long: 1 -1.27,0; 2 1.27,0
1X01 = drill 1.016 octagon: 1 0,0
0402_CAP = smd 0.536 x 0.546: 1 -0.433,0; 2 0.433,0
0603_CAP = smd 0.7 x 1: 1 -0.65,0; 2 0.65,0
FA-128 = smd 0.95 x 0.85: 1 -0.725,-0.575; 2 0.725,-0.575; 3 0.725,0.575; 4 -0.725,0.575
FC-12M = smd 0.7 x 1.4: 1 -0.85,0; 2 0.85,0
R0402 = smd 0.7 x 0.9: 1 -0.65,0; 2 0.65,0
R0603 = smd 1 x 1.1: 1 -0.85,0; 2 0.85,0
0402-RES = smd 0.7 x 0.9: 1 -0.65,0; 2 0.65,0
0603-RES = smd 0.7 x 1: 1 -0.65,0; 2 0.65,0
SJ = smd 1.168 x 1.6: 1 -0.762,0; 2 0.762,0
MA03-1 = drill 1.016 long: 1 -2.54,0; 2 0,0; 3 2.54,0
QFN24_PAD = smd 0.5 x 0.25: 1 -1.55,1; 2 -1.55,0.6; 3 -1.55,0.2; 4 -1.55,-0.2; 5 -1.55,-0.6; 6 -1.55,-1; 13 1.55,-1; 14 1.55,-0.6; 15 1.55,-0.2; 16 1.55,0.2; 17 1.55,0.6; 18 1.55,1 | smd 0.08 x 0.13: 1$1 -1.32,1.06; 1$3 -1.26,0.94; P$33 1.26,-0.94; P$34 1.32,-1.06; P$58 1.26,0.94; P$59 1.32,1.06; P$68 -1.26,-0.94; P$69 -1.32,-1.06 | smd 0.1 x 0.185 rotated 45: 1$2 -1.25,1.024; P$49 1.024,-1.25 | smd 0.14 x 0.14: 1$4 -1.22,0.945; P$23 -0.945,-1.22; P$24 1.22,-0.945; P$36 0.945,1.22; P$51 0.945,-1.22; P$56 1.22,0.945; P$61 -0.945,1.22; P$66 -1.22,-0.945 | smd 0.05 x 0.05: 1$5 -1.175,0.97; P$25 -0.97,-1.175; P$31 1.175,-0.97; P$37 0.97,1.175; P$52 0.97,-1.175; P$57 1.175,0.97; P$62 -0.97,1.175; P$67 -1.175,-0.97 | smd 0.25 x 0.5: 7 -1,-1.55; 8 -0.6,-1.55; 9 -0.2,-1.55; 10 0.2,-1.55; 11 0.6,-1.55; 12 1,-1.55; 19 1,1.55; 20 0.6,1.55; 21 0.2,1.55; 22 -0.2,1.55; 23 -0.6,1.55; 24 -1,1.55 | smd 0.25 x 0.25: CENTER 0,0 | smd 0.4 x 0.4: DBBADFE -0.675,0.24 | smd 0.6 x 1.2: DBBADFE1 -0.575,-0.195 | smd 0.25 x 0.3: P$1 -0.2,1.3; P$3 0.2,1.3; P$5 0.6,1.3; P$11 -0.6,1.3; P$16 0.2,-1.3; P$18 -0.2,-1.3; P$20 -0.6,-1.3; P$26 0.6,-1.3 | smd 0.3 x 0.25: P$2 -1.3,0.2; P$4 -1.3,0.6; P$28 -1.3,-0.2; P$38 -1.3,-0.6; P$40 1.3,0.2; P$42 1.3,-0.2; P$44 1.3,-0.6; P$50 1.3,0.6 | smd 0.1 x 0.185 rotated 225: P$7 1.25,-1.024; P$60 -1.024,1.25 | smd 1.1 x 1.59: P$13 0.325,0 | smd 0.3 x 0.5 rotated 315: P$14 -0.592,0.512 | smd 0.5 x 1.59: P$15 -0.27,0 | smd 0.1 x 0.185 rotated 135: P$22 -1.024,-1.25; P$55 1.25,1.024 | smd 0.13 x 0.08: P$27 -0.94,-1.26; P$29 -1.06,-1.32; P$39 0.94,1.26; P$41 1.06,1.32; P$53 0.94,-1.26; P$54 1.06,-1.32; P$63 -0.94,1.26; P$64 -1.06,1.32 | smd 0.1 x 0.185 rotated 315: P$35 1.024,1.25; P$65 -1.25,-1.024
SOP65P640X120-14N = smd 1.473 x 0.356: 1 -2.819,1.956; 2 -2.819,1.295; 3 -2.819,0.66; 4 -2.819,0; 5 -2.819,-0.66; 6 -2.819,-1.295; 7 -2.819,-1.956; 8 2.819,-1.956; 9 2.819,-1.295; 10 2.819,-0.66; 11 2.819,0; 12 2.819,0.66; 13 2.819,1.295; 14 2.819,1.956
SOP65P490X110-8N = smd 1.499 x 0.432: 1 -2.184,0.965; 2 -2.184,0.33; 3 -2.184,-0.33; 4 -2.184,-0.965; 5 2.184,-0.965; 6 2.184,-0.33; 7 2.184,0.33; 8 2.184,0.965
SOT23-5 = smd 0.55 x 1.2: 1 -0.95,-1.3; 2 0,-1.3; 3 0.95,-1.3; 4 0.95,1.3; 5 -0.95,1.3
SOT-25 = smd 0.55 x 0.8: 1 -0.95,-1.2; 2 0,-1.2; 3 0.95,-1.2; 4 0.95,1.2; 5 -0.95,1.2
S-PVQFN-N32 = smd 0.26 x 0.85: 1 -0.48,-2.5; 2 0.02,-2.5; 3 0.52,-2.5; 4 1.02,-2.5; 5 1.52,-2.5; 6 2.02,-2.5; 7 2.52,-2.5; 8 3.02,-2.5; 17 3.02,2.5; 18 2.52,2.5; 19 2.02,2.5; 20 1.52,2.5; 21 1.02,2.5; 22 0.52,2.5; 23 0.02,2.5; 24 -0.48,2.5 | smd 0.85 x 0.26: 9 3.77,-1.75; 10 3.77,-1.25; 11 3.77,-0.75; 12 3.77,-0.25; 13 3.77,0.25; 14 3.77,0.75; 15 3.77,1.25; 16 3.77,1.75; 25 -1.23,1.75; 26 -1.23,1.25; 27 -1.23,0.75; 28 -1.23,0.25; 29 -1.23,-0.25; 30 -1.23,-0.75; 31 -1.23,-1.25; 32 -1.23,-1.75 | smd 3.45 x 3.45: 33 1.27,0
DFN/LCC-6 = smd 0.2 x 0.3: BAL -0.52,0.41; BAL1 -0.52,-0.41; GND 0,-0.41; GND@1 0.52,-0.41; NC 0,0.41; UB_OUT 0.52,0.41
MSOP8 = smd 0.4 x 1.1: 1 -0.975,-2.25; 2 -0.325,-2.25; 3 0.325,-2.25; 4 0.975,-2.25; 5 0.975,2.25; 6 0.325,2.25; 7 -0.325,2.25; 8 -0.975,2.25
2450AT42B100 = smd 1 x 2: 1 -2.45,0; FEED 2.55,0 | smd 2.8 x 0.7: P$1 0,0.8; P$2 0,-0.8
SOD-523 = smd 0.8 x 0.6: A 0,-0.8; K 0,0.8
USB-MICROB = smd 0.35 x 1.4: D+ 0,2.65; D- -0.65,2.65; GND 1.3,2.65; ID 0.65,2.65; VBUS -1.3,2.65 | smd 1.8 x 1.9: MT1 -4,0; MT2 4,0

### Placement (x,y rotation side)
AD_POW_JUMP  22.35,3.05 90 bottom
B130LAW  11.56,42.04 180 top
C1  12.34,33.22 270 top
C2  24.64,14.99 0 top
C3  24.64,8.64 270 top
C4  32.26,5.59 270 top
C5  5.9,11.26 180 top
C6  30.22,40.78 270 top
C7  5.85,14.76 180 top
C8  12.8,7.51 270 top
C9  15.76,7.5 270 top
C10  18.85,14.17 0 top
C11  9.88,21.21 180 top
C12  20.51,12.03 270 top
C13  17.86,12.03 270 top
C14  19.22,12.06 270 top
C15  13.24,22.77 0 top
C16  13.29,21.19 0 top
C17  18.24,23.02 90 top
C18  19.68,23.02 90 top
C19  18.04,19.42 90 top
C20  19.5,19.41 90 top
C21  30.73,22.35 0 top
C22  33.27,16.76 0 top
C23  3.84,25.98 180 top
C24  2.02,19.05 270 top
C25  34.29,8.89 90 top
C26  41.4,6.1 270 top
C27  41.15,40.64 270 top
C28  40.64,20.83 0 top
C54  7.78,37.66 270 top
C55  12.13,39.97 180 top
C56  15.29,33.55 90 top
C57  19.01,34.9 0 top
D3  15.75,3.68 180 top
D4  6.44,33.01 270 top
DIGIPOT  11.4,28.87 270 top
DIGIPOT1  11.94,25.65 270 top
DIODE_JUMP  24.38,7.62 90 bottom
DMP  18.08,41.48 270 top
J1  15.24,40.26 0 bottom
JP2  2.29,13.72 270 top
JP3  2.29,8.38 270 top
JP4  6.73,6.8 0 top
JP5  5.33,42.16 0 top
L1  9.07,2.57 180 top
L2  10.19,2.13 90 top
L6  18.37,16.05 0 top
L7  15.38,19.06 90 top
LED2  24.89,21.84 270 top
Q1  5.96,12.97 0 top
Q2  14.28,7.28 90 top
Q3  18.54,5.84 180 top
Q5  21.84,7.37 270 top
R1  9.84,22.73 0 top
R2  26.92,28.7 270 top
R3  25.4,28.7 270 top
R4  4.57,31.34 180 top
R5  23.62,28.7 270 top
R6  23.88,17.78 90 top
R7  25.4,17.78 90 top
R8  24.89,23.88 0 top
R9  32.26,34.29 180 top
R10  27.69,40.89 270 top
R11  23.88,34.04 270 top
R12  23.88,37.34 270 top
R13  26.16,40.89 90 top
R14  32,40.64 270 top
R15  30.73,18.03 270 top
R16  29.97,13.46 90 top
R17  31.75,13.46 270 top
R18  27.43,4.57 180 top
R19  10.19,33.01 180 top
R20  37.34,27.69 270 top
R21  30.99,8.64 90 top
R22  35.56,27.69 270 top
R23  33.53,27.43 270 top
R24  8.2,35 180 top
R25  18.69,8.23 0 top
R26  17.65,1.91 180 top
R27  32.44,19.02 90 top
R28  34.29,19.05 90 top
R29  21.34,3.56 270 top
R30  43.69,31.5 90 top
R31  38.86,40.64 270 top
R32  35.05,34.04 270 top
R33  34.29,36.83 0 top
R34  37.34,40.64 90 top
R35  43.18,40.64 270 top
R36  40.64,18.29 270 top
R37  41.66,14.73 90 top
R38  39.88,14.73 270 top
R39  36.83,5.08 180 top
R40  39.62,9.14 90 top
R41  22.1,10.16 180 top
SJ1  31.75,5.08 90 bottom
SV1  27.53,2.16 180 top
SV2  36.58,2.54 180 top
U1  4.75,22.97 180 top
U2  27.69,34.8 90 top
U3  27.94,18.54 90 top
U4  11.45,37.37 90 top
U5  39.12,35.05 90 top
U6  18.07,37.83 270 top
U7  37.08,17.53 90 top
U$1  10.72,13.79 0 top
U$2  10.49,9.1 270 top
U$3  36.83,9.14 0 top
U$4  3.84,2.33 0 top
U$5  27.43,8.64 0 top
U$6  32.77,30.99 270 top
U$7  23.11,12.19 270 top
U$8  41.4,28.19 180 top
U$9  [BLOCK-M]  44.45,16 0 bottom
VIBNEG  13.72,2.03 0 top
X1  1.51,37.07 270 top

### Tracks (layer width: path | path; a pad name or v marks a point on that pad's centre or on a via)
3V3A  (via drill 0.6)
  Top 0.508: v22.31,14.34 v22.31,14.33 U$7.A | Q3.3 19.73,4.74 v20.07,5.08
  Bottom 0.406: AD_POW_JUMP.2 21.21,3.94 v20.07,5.08 | DIODE_JUMP.1 24.09,7.32 22.31,7.32
  Bottom 0.508: v20.07,5.08 22.31,7.32 v22.31,14.34
5VIN  (via drill 0.51)
  Top 0.203: B130LAW.A 9.35,41.73
  Top 0.406: 6.25,38.37 7.71,38.37 C54.1 10.14,38.31 U4.4 9.35,39.12 9.35,41.73 | 6.25,38.37 5.69,37.81 D4.A 5.22,32.54 R4.1 | DMP.1 20.81,42.43 v20.85,42.47 | v7.98,41.99 9.61,41.99 B130LAW.A | X1.VBUS 6.25,38.37
  Route15 0.406: v7.98,41.99 8.46,42.47 v20.85,42.47
24M_NEGA
  Top 0.203: 6.72,13.87 Q1.3 7.4,13.03 9.47,13.03 U$1.30
  Top 0.254: C7.1 6.5,13.73 Q1.3
24M_P
  Top 0.203: 5.38,12.68 Q1.1 5.41,12.4 C5.1 7.72,11.25 8.51,12.04 8.51,12.55 U$1.31
+1.8V  (via drill 0.41)
  Top 0.203: C17.1 C18.1 | 18.02,18.79 C19.1 | C20.1 | L7.2 14.66,19.71 v14.02,19.07 | U$1.29 8.1,13.54 v7.87,13.74 | U$1.32 9.33,12.04 v7.9,10.41
  Top 0.254: 18.02,18.79 19.47,18.79 C20.1 21.08,20.33 21.08,21.54 20.24,22.38 C18.1 C17.1 | L7.2 17.09,19.71 C19.1
  Bottom 0.203: v14.02,19.07 13.36,19.07 v7.87,13.74 7.9,13.61 v7.9,10.41
+3V3  (via drill 0.41, 0.51, 0.6)
  Top 0.203: C24.1 2.02,23.93 | 2.02,23.93 v2.02,28.13 | 7.34,29.77 7.37,29.79 | U1.13 2.06,23.97 2.02,23.93
  Top 0.254: 5.71,25.25 5.35,24.88 U1.8 | 5.71,25.25 6.25,25.25 6.91,24.59 6.91,22.02 6.86,21.97 U1.1 | U1.13 2.8,23.97 2.79,23.98 | 5.71,25.25 6.02,25.55 6.02,26.39 3.63,28.63 v3.63,29.77 7.34,29.77 | 7.37,29.79 7.54,29.97 DIGIPOT.1 11.43,29.97 11.94,29.46 12.45,29.46 | 12.45,29.46 DIGIPOT.9 14.81,29.47 v18.54,33.2 | DIGIPOT1.1 12.17,26.75 12.45,27.02 | 12.45,27.02 12.45,29.46 | 12.45,27.02 13.22,26.25 DIGIPOT1.9
  Top 0.406: U6.5 20.01,38.78 v20.93,39.7 | C57.1 18.06,33.68 v18.54,33.2 | v16.97,17.27 17.72,16.52 L6.1 17.72,16.45 | Q3.2 17.59,7.78 R25.1
  Top 0.508: L6.1 17.72,16.7 18.29,17.27 21.08,17.27 v21.59,16.76 | v17.02,8.89 17.38,8.89 R25.1
  Route15 0.406: v16.05,24.13 19.91,20.27 20.65,20.27 v22.07,21.69 | JP5.1 7.8,39.7 v20.93,39.7
  Bottom 0.203: v2.02,28.13 2.02,28.15 v3.63,29.77
  Bottom 0.406: v20.93,39.7 20.93,35.59 v18.54,33.2 16.97,31.62 16.97,25.04 | 16.97,25.04 v16.05,24.13 | 16.97,25.04 v16.97,17.27
  Bottom 0.508: v21.59,16.76 20.83,16.76 19.56,15.49 19.56,11.43 v17.02,8.89 17.02,3.3 17.27,3.05 AD_POW_JUMP.1
ANALOG_EN
  Top 0.203: U$1.7 13.24,10.51 13.95,9.8 17.97,9.8 R25.2 | 15.86,5.45 15.75,5.33 D3.A
  Top 0.254: 15.86,5.45 17.64,5.45 18.03,5.84 18.49,5.84 Q3.1
  Top 0.406: R25.2 19.34,6.99 arc90 Q3.1
CH1_IN+
  Top 0.406: SV1.1 30.07,4.73 28.96,5.84 28.95,5.84 U$5.4
CH1_IN+2
  Top 0.406: U$3.4 39.37,5.33 39.37,2.79 SV2.1
CH1_IN-
  Top 0.406: SV1.3 24.99,4.92 25.91,5.84 U$5.1
CH1_IN-2
  Top 0.406: SV2.3 34.04,5.08 U$3.1
DCOUPLE_ME
  Top 0.203: U$1.12 15.66,13.54 16,13.21 17.02,13.21 17.27,13.46 17.27,13.97 17.47,14.17 C10.1
DIO_0  (via drill 0.36)
  Top 0.203: U$1.6 12.74,10.45 14.05,9.14 v14.99,9.14
  Top 0.254: DIGIPOT1.5 9.84,24.45 v10.16,24.13
  Route2 0.254: v10.16,24.13 10.16,21.34 9.4,20.57 9.4,19.56 11.18,17.78 15.24,17.78 18.03,14.99 18.03,12.19 v14.99,9.14
DIO_2  (via drill 0.41)
  Top 0.203: U$1.8 13.74,10.9 14.35,10.29 14.88,10.29 v15.29,10.69 | v11.18,27.94 11.15,27.97 DIGIPOT.5
  Bottom 0.203: v15.29,10.69 15.7,11.1 16.18,11.1 18.03,12.95 18.03,14.99 16,17.02 16,22.84 11.18,27.66 v11.18,27.94
DIO_9
  Top 0.203: U$1.22 11.23,16.31 11.23,17.42 8.53,20.12 6.71,20.12 5.75,21.07 U1.24
DIO_10
  Top 0.203: U$1.23 10.74,17.2 8.23,19.71 6.43,19.71 5.35,20.79 U1.23
DIO_11  (via drill 0.36, 0.41)
  Top 0.203: v4.52,28.78 4.88,29.13 7.54,29.13 7.87,29.46 DIGIPOT.2 | U$1.24 10.24,16.94 8.15,19.02 6.02,19.02 v5.31,19.74 4.95,20.09 U1.22
  Top 0.254: DIGIPOT1.2 9.82,26.24 v8.56,26.24
  Route15 0.254: v8.56,26.24 7.06,26.24 v4.52,28.78
  Bottom 0.203: v4.52,28.78 4.52,20.52 v5.31,19.74
DIO_12  (via drill 0.36, 0.41)
  Top 0.203: U$1.25 | v8.38,27.18 8.38,28.19 8.66,28.47 DIGIPOT.4
  Top 0.254: DIGIPOT1.4 11.28,25.25 v11.43,25.4 | v6.6,17.53 8.89,17.53 9.49,16.93 U$1.25
  Route2 0.254: v11.43,25.4 10.16,25.4 v8.38,27.18
  Bottom 0.203: 6.1,26.16 6.1,17.78 6.35,17.53 v6.6,17.53 | 8.13,26.67 8.38,26.92 v8.38,27.18
  Bottom 0.254: 6.1,26.16 6.6,26.67 8.13,26.67
DIO_14  (via drill 0.41)
  Top 0.203: U$1.27 9.46,14.58 8.84,14.58 7.8,15.62 v7.8,16.26 | 7.12,27.18 7.87,27.94 7.87,28.7 8.14,28.97 DIGIPOT.3
  Top 0.254: 7.12,27.18 6.6,26.67 6.6,25.78 v7.8,24.59 8.96,25.75 DIGIPOT1.3
  Bottom 0.203: v7.8,24.59 v7.8,16.26
FIRST_STAGE_OUT
  Top 0.406: U$5.7 27.11,13.37 C2.2
FIRST_STAGE_OUT2
  Top 0.254: U$3.7 36.51,12.77 34.29,14.99 34.29,16.6 C22.2
GND  (via drill 0.36, 0.41)
  Top 0.127: v11.98,14.87 v11.99,14.86
  Top 0.152: U$1.33
  Top 0.203: C11.2 7.22,21.21 v7.09,21.08 | v3.63,17.73 3.63,20.09 4.17,20.32 4.17,21.4 U1.20 | R41.1 22.75,9.14
  Top 0.254: U1.CENTER 4.15,22.97 U1.20
  Top 0.406: C8.2 12.83,6.83 v12.83,4.55 | U6.2 16.86,37.85 14.99,37.85 14.51,37.37 U4.2
  Top 0.813: 23.62,42.67 22.35,41.4 21.84,41.4 21.34,40.89 20.57,40.89
  Route2 0.203: v7.09,21.08 7.09,20.42 v3.63,17.73
  Bottom 0.406: v12.83,4.55 12.85,4.57 14.15,4.57
  other vias: 1.8,4.8 3.2,4.8 4.2,4.8 5.2,4.8 6.2,4.8 7.2,4.8 10.2,5.8 9.4,3.4 8.6,4 8.4,4.8 10.2,3.8 10.2,4.8 10.2,6.8 10.2,7.8 11.6,7.8 11.6,6.8 11.6,5.8 11.6,4.8 11.6,3.8 11.6,2.8 13,14.87 10.97,14.87 12.01,13.77 11,13.77 11,12.73 12.01,12.73 13.03,12.73 13.03,13.77 8.6,1.65 8.61,0.76 9.61,0.76 10.6,0.77 11.09,2.04 11.36,1.16 0.78,4.8
  pour Top: 0.03,43.79 0,43.79 0.09,4.37 8.09,4.35 8.14,0.61 8.12,-0.01 21.72,0 21.72,1.85 21.69,1.85 21.69,43.87 -0.03,43.87 -0.03,43.81
  pour Bottom: 21.67,43.97 0.03,43.87 0,16.61 3.68,16.61 3.68,8.23 9.12,8.23 9.12,11.81 11.79,11.81 11.79,-0.15 21.67,-0.15
  pour Top: 24.21,43.33 22.78,43.41 22.81,0.15 45.24,0.15 45.24,43.61 27.41,43.41 27.1,43.36
  pour Bottom: 22.86,43.94 45.21,43.94 45.21,0.25 22.86,0.25
IN_A-
  Top 0.254: U2.2 26.34,31.93 26.34,30.41 25.48,29.55 R3.1 25.32,29.55 R5.2
IN_A-2
  Top 0.254: U5.2 37.82,30.8 R22.1 35.48,28.54 R23.2
IN_C+
  Top 0.254: U2.10 28.35,38.76 28.96,39.37 28.96,41.66 | 27.8,41.63 R10.1 27.77,41.66 28.96,41.66 | C6.1 29.94,41.66 28.96,41.66
IN_C+2
  Top 0.254: R31.1 40.13,41.49 | 40.13,41.49 C27.1 | U5.10 39.77,38.78 40.13,39.14 40.13,41.49
IN_C-  (via drill 0.41, 0.51)
  Top 0.254: DIGIPOT.8 14.11,28.96 19.81,28.96 22.35,31.5 v22.35,32 | v28.96,36.07 28.98,36.09 | 28.98,36.09 U2.9 | 28.98,36.09 28.98,34.77 29.21,34.54 30.23,34.54 30.48,34.29 R9.2
  Bottom 0.254: v22.35,32 26.42,36.07 v28.96,36.07
IN_C-2  (via drill 0.36, 0.51)
  Top 0.254: DIGIPOT1.8 18.9,25.75 v19.81,26.67 | U5.9 40.41,36.09 v39.88,35.56 39.88,34.54 40.13,34.29 43.35,34.29 43.69,33.95 R30.2
  Bottom 0.254: v19.81,26.67 20.32,26.67 20.83,27.18 31.5,27.18 v39.88,35.56
IN_D+
  Top 0.254: U2.12 27.01,37.6 27.01,36.04 25.86,34.89 R11.1 R12.2
IN_D+2
  Top 0.254: R32.1 35.05,36.74 R33.2 35.65,36.32 38.35,36.32 38.46,36.42 U5.12
IN_D-  (via drill 0.41, 0.51)
  Top 0.254: U2.13 26.39,39.51 R13.1 24.98,40.04 v24.64,40.39 | R14.1 32.09,41.4 v33.27,41.4
  Bottom 0.254: v33.27,41.4 32.26,40.39 v24.64,40.39
IN_D-2  (via drill 0.51)
  Top 0.254: U5.13 37.82,39.31 R34.1 36.16,39.79 v35.81,40.13 | v43.18,42.67 R35.1
  Bottom 0.254: v35.81,40.13 35.81,40.89 37.34,42.42 42.93,42.42 v43.18,42.67
INA-
  Top 0.406: 25.15,19.56 25.4,19.3 R7.2 | R7.2 25.82,18.63 26.67,17.78 27.43,17.78 27.61,17.6 U3.2 | R6.2 R7.2
INA-2
  Top 0.254: U7.2 36.75,17.86 36.58,18.03 36.07,18.03 35.31,18.8 35.31,19.81 35.05,20.07 34.46,20.07 R28.2 32.47,19.9 R27.2
INB+
  Top 0.254: 29.88,21.17 30.48,20.57
  Top 0.406: R15.1 30.73,20.32 30.48,20.57 30.33,20.73 U3.5 | 29.88,21.17 C21.1
INB+2
  Top 0.406: U7.5 38.67,19.71 C28.1 40.64,19.98 R36.1
JTAG_TCKC  (via drill 0.41)
  Top 0.203: v15.62,14.55 U$1.14 | v4.83,16.26 3.56,16.26 JP2.1
  Route15 0.203: v4.83,16.26 6.35,16.26 7.62,17.53 11.94,17.53 13.72,15.75 | 15.55,14.48 v15.62,14.55
  Route15 0.254: 15.55,14.48 14.99,14.48 13.72,15.75
JTAG_TDI  (via drill 0.41)
  Top 0.203: U$1.16 15.04,15.54 v15.49,16
  Bottom 0.203: v15.49,16 14.48,14.99 14.48,12.7 13.72,11.94 9.91,11.94 9.14,11.18 9.14,10.41 8.13,9.4 2.54,9.4 JP3.1
JTAG_TDO  (via drill 0.41)
  Top 0.203: U$1.15 15.3,15.04 15.49,15.24 v16.26,15.24 | v4.83,8.64 3.81,8.64 JP3.2
  Route2 0.203: v4.83,8.64 4.83,9.14 8.64,12.95 8.64,14.73 9.65,15.75 13.79,15.75 U$1.15 15.3,15.04 15.49,15.24 v16.26,15.24
JTAG_TSMC  (via drill 0.41)
  Top 0.203: U$1.13 15.16,14.04 15.24,13.97 16.26,13.97 v16.51,14.22 | v6.86,8.38 6.15,8.38 JP2.2
  Bottom 0.203: v16.51,14.22 16.51,13.97 13.97,11.43 10.16,11.43 9.65,10.92 9.65,9.4 9.14,8.89 7.37,8.89 v6.86,8.38
LDO_IN
  Top 0.406: 17.81,38.78 19.18,40.15 DMP.3 16.31,41.48 15.75,42.04 B130LAW.C | 17.81,38.78 18.03,38.56 18.03,37.08 17.83,36.88 U6.3 15.29,35.3 C56.2 12.97,34.5 C1.1 | U6.1 17.81,38.78
MOTOROUT  (via drill 0.36)
  Top 0.406: v21.08,1.27 21.34,1.52 R29.2
  Bottom 0.406: VIBNEG.1 20.32,2.03 v21.08,1.27
N$1
  Top 0.406: C2.1 23.79,16.84 R6.1
N$2
  Top 0.203: R24.1 8.85,35.12 U4.5
N$3
  Top 0.203: D4.C R19.2
N$4
  Top 0.302: 9.39,2.46 L1.1 L2.2 | 10.22,2.6 L2.2 | U$2.UB_OUT 10.9,3.28 L2.2
N$5
  Top 0.254: R26.2 16.23,2.68 16,2.68 D3.C
N$6
  Top 0.406: U$5.2 27.11,5.1 R18.2
N$7
  Top 0.302: L1.2 6.63,2.57 U$4.FEED
N$8
  Top 0.254: R17.1 30.73,15.33 R15.2
  Top 0.406: R16.2 29.97,16.42 R15.2
N$9
  pour Route2: 0,43.94 0,4.57 8.64,4.57 8.64,0 21.84,0 21.84,0.25 21.59,0.25 21.59,43.94
N$10
  Top 0.254: LED2.A 24.04,22.25 R8.1
N$11
  Top 0.406: U$5.3 27.76,5.1 R18.1
N$12
  Top 0.254: 32.51,16.85 C22.1 32.42,18.16 R27.1
N$13
  Top 0.406: U$3.2 36.51,5.61 R39.2
N$14
  Top 0.203: U4.1 12.75,36.3 11.79,35.33 11.38,35.33 10.87,34.82 10.87,33.04 R19.1
N$15
  Top 0.406: U$3.3 37.16,5.61 R39.1
N$16
  Top 0.406: R38.1 39.88,16.68 R36.2 41.66,16.42 R37.2
N$17
  Top 0.406: R29.1 22.94,5.81 Q5.3
OUT_A  (via drill 0.41)
  Top 0.254: 24.66,31.98 v24.64,32 24.64,32.42 R11.2 | 24.66,31.98 U2.1 | 24.66,31.98 24.66,31.27 23.62,30.23 R5.1
OUT_A2
  Top 0.254: R23.1 37.16,31.91 U5.1 36.01,32.23 R32.2
OUT_B
  Top 0.254: U2.7 30.63,30.99 U$6.A
OUT_B2
  Top 0.254: U5.7 41.07,29.32 U$8.A
OUT_D
  Top 0.254: U2.14 25.73,38.53 24.89,39.37 24.64,39.37 23.88,40.13 23.88,41.15 24.38,41.66 26.07,41.66 R13.2 27.69,40.22 R10.2
OUT_D2
  Top 0.254: R31.2 37.34,41.31 R34.2 35.39,41.49 34.8,40.89 34.8,39.62 35.81,38.61 36.07,38.61 36.8,37.87 U5.14
OUT_DIODE
  Top 0.254: U$6.K 31.28,33.27 29.21,33.27 | 29.21,33.27 28.98,33.05 U2.6 | 29.21,33.27 27.43,33.27 27.03,32.87 U2.3 26.92,31.88 R2.1
OUT_DIODE2
  Top 0.254: R20.1 38.46,29.65 U5.3 38.46,33.63 38.61,33.78 40.39,33.78 | U5.6 40.39,32.26 40.39,33.78 | U$8.K 42.13,27.39 42.42,27.69 42.42,32.51 41.4,33.53 40.64,33.53 40.39,33.78
OUTA  (via drill 0.41, 0.51)
  Top 0.203: v24.38,25.4 25.4,26.42 R3.2
  Top 0.254: R3.2 R2.2 | R7.1 25.31,17.02
  Top 0.406: R7.1 26.4,16.93 U3.1 26.92,16.31 v26.92,14.99
  Route2 0.254: v26.92,14.99 24.38,17.53 v24.38,25.4
OUTA2  (via drill 0.51)
  Top 0.254: R20.2 R22.2 35.31,26.58 v35.31,25.4 | U7.1 36.07,15.39 v36.07,17.02 34.89,18.2 R28.1
  Route15 0.254: v36.07,17.02 36.07,24.64 v35.31,25.4
RAW_REG_OUT
  Top 0.254: U$1.17 14.77,16.3 15.24,16.76 15.24,18.27 L7.1
REF  (via drill 0.51)
  Top 0.406: v29.72,7.62 29.88,7.79 R21.1
  Bottom 0.406: SV1.2 28.45,3.08 28.45,4.06 28.45,5.33 29.72,6.6 v29.72,7.62
  Bottom 0.457: SJ1.1 28.7,4.32 28.45,4.06
REF2  (via drill 0.51)
  Top 0.406: v39.62,6.86 R40.1
  Route15 0.406: SV2.2 36.58,4.57 37.59,5.59 38.35,5.59 v39.62,6.86
  Bottom 0.457: SJ1.2 35.31,5.84 36.58,4.57 SV2.2
REF_OUT  (via drill 0.51)
  Top 0.254: R14.2 30.48,38.27 v30.48,36.07 | v28.84,29.83 28.82,29.85 | 28.82,29.85 28.82,30.68 28.35,31.16 U2.5 | 28.82,29.85 arc-90 28.96,29.72 28.96,23.11 28.7,22.86 28.21,22.86 | U3.7 arc90 27.69,20.8 27.69,22.61 27.94,22.86 28.21,22.86 | U3.6 28.21,20.78 28.21,22.86
  Top 0.406: 28.19,9.4 30.9,9.4 R21.2 31.41,9.49 32.26,8.64 C4.1 | 28.19,9.4 27.76,9.84 U$5.6 27.76,14.29 28.27,14.81 U3.3 U3.6 | 28.19,9.4 26.58,7.79 C3.2 24.64,7.62 24.38,7.37
  Route15 0.254: v30.48,36.07 30.48,34.04 28.96,32.51 28.96,29.94 v28.84,29.83
REF_OUT2  (via drill 0.51)
  Top 0.254: U5.5 39.78,30.07 v39.88,29.97 39.88,24.38 37.08,21.59 | C25.2 34.38,9.65 36.83,9.65 37.16,9.98 | 37.16,9.98 U$3.6 | R40.2 39.61,9.98 37.16,9.98 | R35.2 v43.18,35.81
  Top 0.406: U7.7 36.75,21.26 37.08,21.59 37.41,21.26 U7.6 U7.3 37.41,13.24 37.15,12.98 U$3.6 | R40.2 41.4,8.22 C26.1
  Route15 0.254: v43.18,35.81 42.16,34.8 42.16,34.04 41.66,33.53 40.39,33.53 39.88,33.02 v39.88,29.97
REGOUT
  Top 0.203: U1.10 4.55,25.84 C23.1
RESET_N  (via drill 0.41)
  Top 0.203: U$1.19 12.72,16.31 12.72,17.5 11.94,18.29 11.94,21.08 11.81,21.21 C11.1
  Top 0.254: R1.1 9.19,22.55 C11.1 10.53,20.57 v10.02,20.07
  Route15 0.203: 7.87,8.89 6.1,10.67 4.06,10.67 3.81,10.92 3.81,16.51 4.32,17.02 4.83,17.02 5.33,17.53 5.33,17.78 7.62,20.07 v10.02,20.07
  Route15 0.254: 7.87,8.89 7.87,6.93 JP4.2
RF_NEG
  Top 0.254: U$1.2 10.74,10.17 | 10.74,10.17 | 10.74,10.17 10.75,10.17 10.92,10 10.92,9.64 U$2.BAL
RF_P
  Top 0.254: U$1.1 10.24,10.17 | 10.24,10.17 | 10.24,10.17 10.24,10.16 10.07,9.99 U$2.BAL1
SIG  (via drill 0.36, 0.41, 0.51)
  Top 0.203: 12.25,17.18 11.18,18.25 v11.18,20.32
  Top 0.254: DIGIPOT.6 15.02,27.97 15.24,28.19 15.24,28.45 | 15.24,28.45 14.12,28.45 DIGIPOT.7 | 15.24,28.45 15.49,28.19 15.75,28.19 20.32,28.19 23.11,30.99 v23.11,31.24 | v29.72,35.31 29.72,37.54 U2.8 | U$1.20 12.25,17.18
  Top 0.406: v15.75,27.43 15.75,28.19
  Route15 0.406: v11.18,20.32 15.75,24.89 v15.75,27.43
  Bottom 0.254: v23.11,31.24 23.11,31.75 26.42,35.05 29.46,35.05 v29.72,35.31
SIG2  (via drill 0.36, 0.51)
  Top 0.254: U5.8 41.15,37.8 v41.15,35.56 | v20.83,26.16 19.81,25.15 17.02,25.15 16.91,25.25 16,25.25 | 16,25.25 DIGIPOT1.7 | 16,25.25 15.5,24.75 DIGIPOT1.6 12.84,24.75 v12.7,24.89 | U$1.26 9.09,15.04 8.38,15.75 v8.38,16.76
  Bottom 0.254: v41.15,35.56 31.75,26.16 v20.83,26.16 | v8.38,16.76 11.94,20.32 11.94,24.13 v12.7,24.89
SWITCH
  Top 0.203: U$1.9 16.4,12.04 16.51,11.94 16.51,10.67 16.76,10.41 19.3,10.41 19.68,10.03 | 21.08,8.38 21.08,8.64 | 19.68,10.03 20.84,8.87 Q5.1 | R41.2 21.45,10.03 19.68,10.03
  Top 0.457: Q5.1 21.02,8.32 21.08,8.38
VBATT  (via drill 0.51)
  Top 0.203: 12.78,38.35 U4.3
  Top 0.406: DMP.2 16.52,39.97 C55.1 12.75,39.97 U4.3 11.43,38.32 v11.43,38.35
  Bottom 0.406: v11.43,38.35 13.99,38.35 14.24,38.1 J1.2
VDD  (via drill 0.41, 0.51)
  Top 0.254: U3.8 26.92,20.78 27.02,20.87 27.02,23.88 | U2.4 27.69,30.99 27.94,30.73 27.94,26.48 27.02,25.55 27.02,23.88 | R8.2 27.02,23.88 | v31.24,11.43 31.28,11.39 32.51,11.39 U$3.8 | U7.8 36.07,19.76 36.07,21.59 36.2,21.72 39.12,24.64 U5.4
  Top 0.406: U$5.8 24.93,10.89 | 24.93,10.89 24.38,11.43 24.38,11.72 U$7.K 23.88,12.23 v23.88,13.46 | v26.92,18.8 26.98,18.85 U3.8 | C3.1 24.93,9.78 24.93,10.89 | R17.2 31.75,11.94 v31.24,11.43 | U$3.8 34.55,12.7 v33.78,12.7 | v34.8,21.84 34.92,21.72 36.2,21.72 | v39.88,12.45 R38.2 | C25.1 32.51,9.82 32.51,11.39
  Bottom 0.406: v23.88,13.46 26.92,16.51 v26.92,18.8 | v31.24,11.43 25.91,11.43 v23.88,13.46 | v33.78,12.7 34.04,12.45 v39.88,12.45 40.64,13.21 40.64,13.72 39.48,14.88 37.44,14.88 37.44,19.49 35.09,21.84 v34.8,21.84 | DIODE_JUMP.2 23.88,9.02 v23.88,13.46
VDDS  (via drill 0.41)
  Top 0.203: 12.55,22.73 12.55,21.28 C16.1
  Top 0.254: U$1.11 14.51,13.03 14.53,13.05 15.58,13.05 15.95,12.68 C13.1 C12.1 19.25,12.68 C14.1 | C15.1 12.55,22.73 R1.2 10.49,22.68 10.41,22.61 | v7.67,14.76 7.92,14.76 8.64,14.04 U$1.28 | U$1.18 13.24,17.91 12.64,18.5 12.64,19.36 13.09,19.81 v13.46,19.81 12.45,21 C16.1 | 20.57,12.74 v20.57,14.99 19.78,15.78 19.02,15.78
  Top 0.305: C14.1 19.22,12.45
  Top 0.406: L6.2 19.02,15.78 | 20.57,12.74 C12.1
  Route15 0.254: v20.57,14.99 17.27,18.29 15.24,18.29 14.94,17.99 13.16,17.99 13.16,19.51 v13.46,19.81 13.46,19.72
  Bottom 0.254: v7.67,14.76 12.72,19.81 v13.46,19.81
X32K_Q1
  Top 0.127: C8.1 12.77,8.07
  Top 0.203: U$1.4 11.74,9.21 C8.1 | 12.77,8.07 Q2.1
X32K_Q2
  Top 0.127: Q2.2 15.74,8.13 C9.1
  Top 0.203: U$1.5 12.24,10.17 Q2.2

### Text on the board
bPlace: FlexZone rev0 / Designed by James Connolly and Rohit Kumar / Laid out by Phil Ring, JC and RK